# EAGLE design clock (EAGLE 5.11)

## Sheet 1 of 4
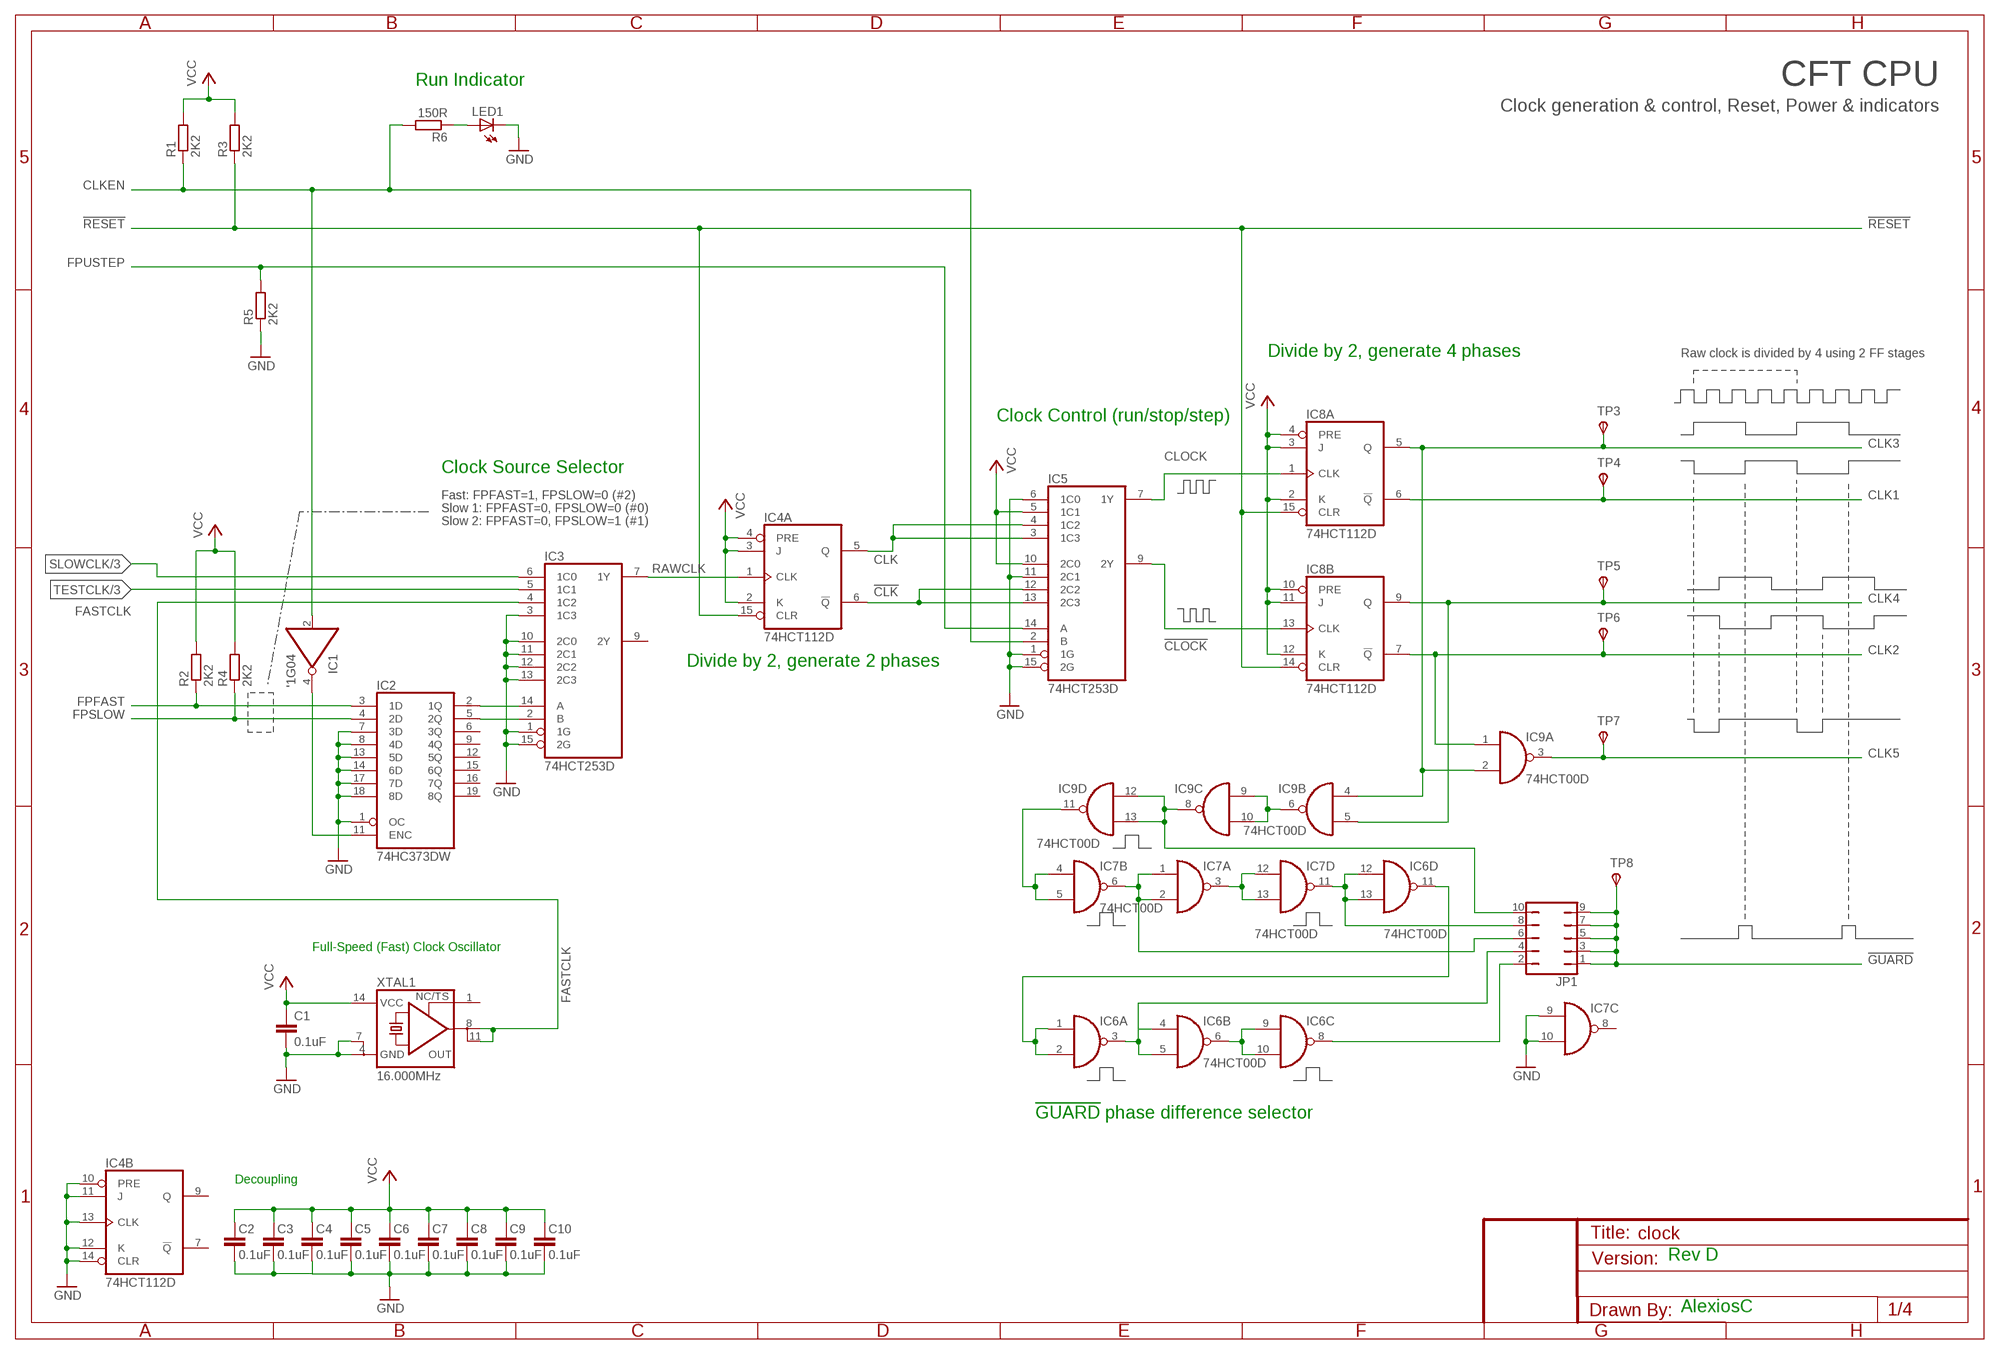
[diagram p0: schematic, sheet 1]

### Parts
C1  0.1uF  C-EUC0805  [C0805]
C2  0.1uF  C-EUC0805  [C0805]
C3  0.1uF  C-EUC0805  [C0805]
C4  0.1uF  C-EUC0805  [C0805]
C5  0.1uF  C-EUC0805  [C0805]
C6  0.1uF  C-EUC0805  [C0805]
C7  0.1uF  C-EUC0805  [C0805]
C8  0.1uF  C-EUC0805  [C0805]
C9  0.1uF  C-EUC0805  [C0805]
C10  0.1uF  C-EUC0805  [C0805]
IC1  '1G04  74AHC1G04DBV  [SOT23-5]
IC2  74HC373DW  [SO20W]
IC3  74HCT253D  [SO16]
IC4  74HCT112D  [SO16]
IC5  74HCT253D  [SO16]
IC6  74HCT00D  [SO14]
IC7  74HCT00D  [SO14]
IC8  74HCT112D  [SO16]
IC9  74HCT00D  [SO14]
JP1  JP5Q  [JP5Q]
LED1  LEDCHIP-LED0805  [CHIP-LED0805]
R1  2K2  R-EU_M0805  [M0805]
R2  2K2  R-EU_M0805  [M0805]
R3  2K2  R-EU_M0805  [M0805]
R4  2K2  R-EU_M0805  [M0805]
R5  2K2  R-EU_R0805  [R0805]
R6  150R  R-EU_R0805  [R0805]
TP3  TPSPAD1-13  [P1-13]
TP4  TPSPAD1-13  [P1-13]
TP5  TPSPAD1-13  [P1-13]
TP6  TPSPAD1-13  [P1-13]
TP7  TPSPAD1-13  [P1-13]
TP8  TPSPAD1-13  [P1-13]
XTAL1  16.000MHz  XO2-08-14-SOCKET  [DIL0814S]

### Nets
!CLK: IC4.6(A:!Q) IC5.12(2C2) IC5.13(2C3)
!CLOCK: IC5.9(2Y) IC8.13(B:CLK)
!GUARD: JP1.1 JP1.3 JP1.5 JP1.7 JP1.9 TP8.TP(PP) ; also sheet 3,4
!RESET: IC4.15(A:CLR) IC8.14(B:CLR) IC8.15(A:CLR) R3.1 ; also sheet 2,3,4
CLK: IC4.5(A:Q) IC5.3(1C3) IC5.4(1C2) ; also sheet 2
CLK1: IC8.6(A:!Q) TP4.TP(PP) ; also sheet 4
CLK2: IC8.7(B:!Q) IC9.1(A:I0) TP6.TP(PP) ; also sheet 4
CLK3: IC8.5(A:Q) IC9.2(A:I1) IC9.4(B:I0) TP3.TP(PP) ; also sheet 4
CLK4: IC8.9(B:Q) IC9.5(B:I1) TP5.TP(PP) ; also sheet 4
CLK5: IC9.3(A:O) TP7.TP(PP) ; also sheet 4
CLKEN: IC1.2(I) IC5.2(B) R1.1 R6.2 ; also sheet 4
CLOCK: IC5.7(1Y) IC8.1(A:CLK)
FASTCLK: IC3.4(1C2) XTAL1.8(OUT) XTAL1.11(OUT1)
FPFAST: IC2.3(1D) R2.1 ; also sheet 4
FPSLOW: IC2.4(2D) R4.1 ; also sheet 4
FPUSTEP: IC5.14(A) R5.2 ; also sheet 4
GND: C1.2 C2.1 C3.1 C4.1 C5.1 C6.1 C7.1 C8.1 C9.1 C10.1 IC2.1(OC) IC2.7(3D) IC2.8(4D) IC2.13(5D) IC2.14(6D) IC2.17(7D) IC2.18(8D) IC3.1(1G) IC3.3(1C3) IC3.10(2C0) IC3.11(2C1) IC3.12(2C2) IC3.13(2C3) IC3.15(2G) IC4.10(B:PRE) IC4.11(B:J) IC4.12(B:K) IC4.13(B:CLK) IC4.14(B:CLR) IC5.1(1G) IC5.6(1C0) IC5.11(2C1) IC5.15(2G) IC7.9(C:I0) IC7.10(C:I1) LED1.C R5.1 XTAL1.4(GND) XTAL1.7(GND1) ; also sheet 2,3,4
N$2: IC6.8(C:O) JP1.2
N$11: IC7.1(A:I0) IC7.2(A:I1) IC7.6(B:O) JP1.6
N$12: IC7.3(A:O) IC7.12(D:I0) IC7.13(D:I1)
N$13: IC6.12(D:I0) IC6.13(D:I1) IC7.11(D:O) JP1.8
N$14: IC6.1(A:I0) IC6.2(A:I1) IC6.11(D:O)
N$15: IC6.3(A:O) IC6.4(B:I0) IC6.5(B:I1) JP1.4
N$16: IC6.6(B:O) IC6.9(C:I0) IC6.10(C:I1)
N$18: IC9.6(B:O) IC9.9(C:I0) IC9.10(C:I1)
N$19: IC9.8(C:O) IC9.12(D:I0) IC9.13(D:I1) JP1.10
N$20: IC7.4(B:I0) IC7.5(B:I1) IC9.11(D:O)
N$34: IC2.2(1Q) IC3.14(A)
N$35: IC2.5(2Q) IC3.2(B)
N$37: IC1.4(O) IC2.11(ENC)
N$49: LED1.A R6.1
RAWCLK: IC3.7(1Y) IC4.1(A:CLK)
SLOWCLK: IC3.6(1C0) ; also sheet 3
TESTCLK: IC3.5(1C1) ; also sheet 3
VCC: C1.1 C2.2 C3.2 C4.2 C5.2 C6.2 C7.2 C8.2 C9.2 C10.2 IC4.2(A:K) IC4.3(A:J) IC4.4(A:PRE) IC5.5(1C1) IC5.10(2C0) IC8.2(A:K) IC8.3(A:J) IC8.4(A:PRE) IC8.10(B:PRE) IC8.11(B:J) IC8.12(B:K) R1.2 R2.2 R3.2 R4.2 XTAL1.14(VCC) ; also sheet 2,3,4
Unconnected: IC2.6(3Q) IC2.9(4Q) IC2.12(5Q) IC2.15(6Q) IC2.16(7Q) IC2.19(8Q) IC3.9(2Y) IC4.7(B:!Q) IC4.9(B:Q) IC7.8(C:O) XTAL1.1(TS)

### Notes on the sheet
- Run Indicator | CFT CPU
- Clock generation & control, Reset, Power & indicators
- Divide by 2, generate 4 phases | Raw clock is divided by 4 using 2 FF stages
- Clock Control (run/stop/step)
- Clock Source Selector
- Fast: FPFAST=1, FPSLOW=0 (#2)
- Slow 1: FPFAST=0, FPSLOW=0 (#0)
- Slow 2: FPFAST=0, FPSLOW=1 (#1)
- Divide by 2, generate 2 phases
- Full-Speed (Fast) Clock Oscillator
- !GUARD! phase difference selector
- Decoupling
- Rev D
- AlexiosC

## Sheet 2 of 4
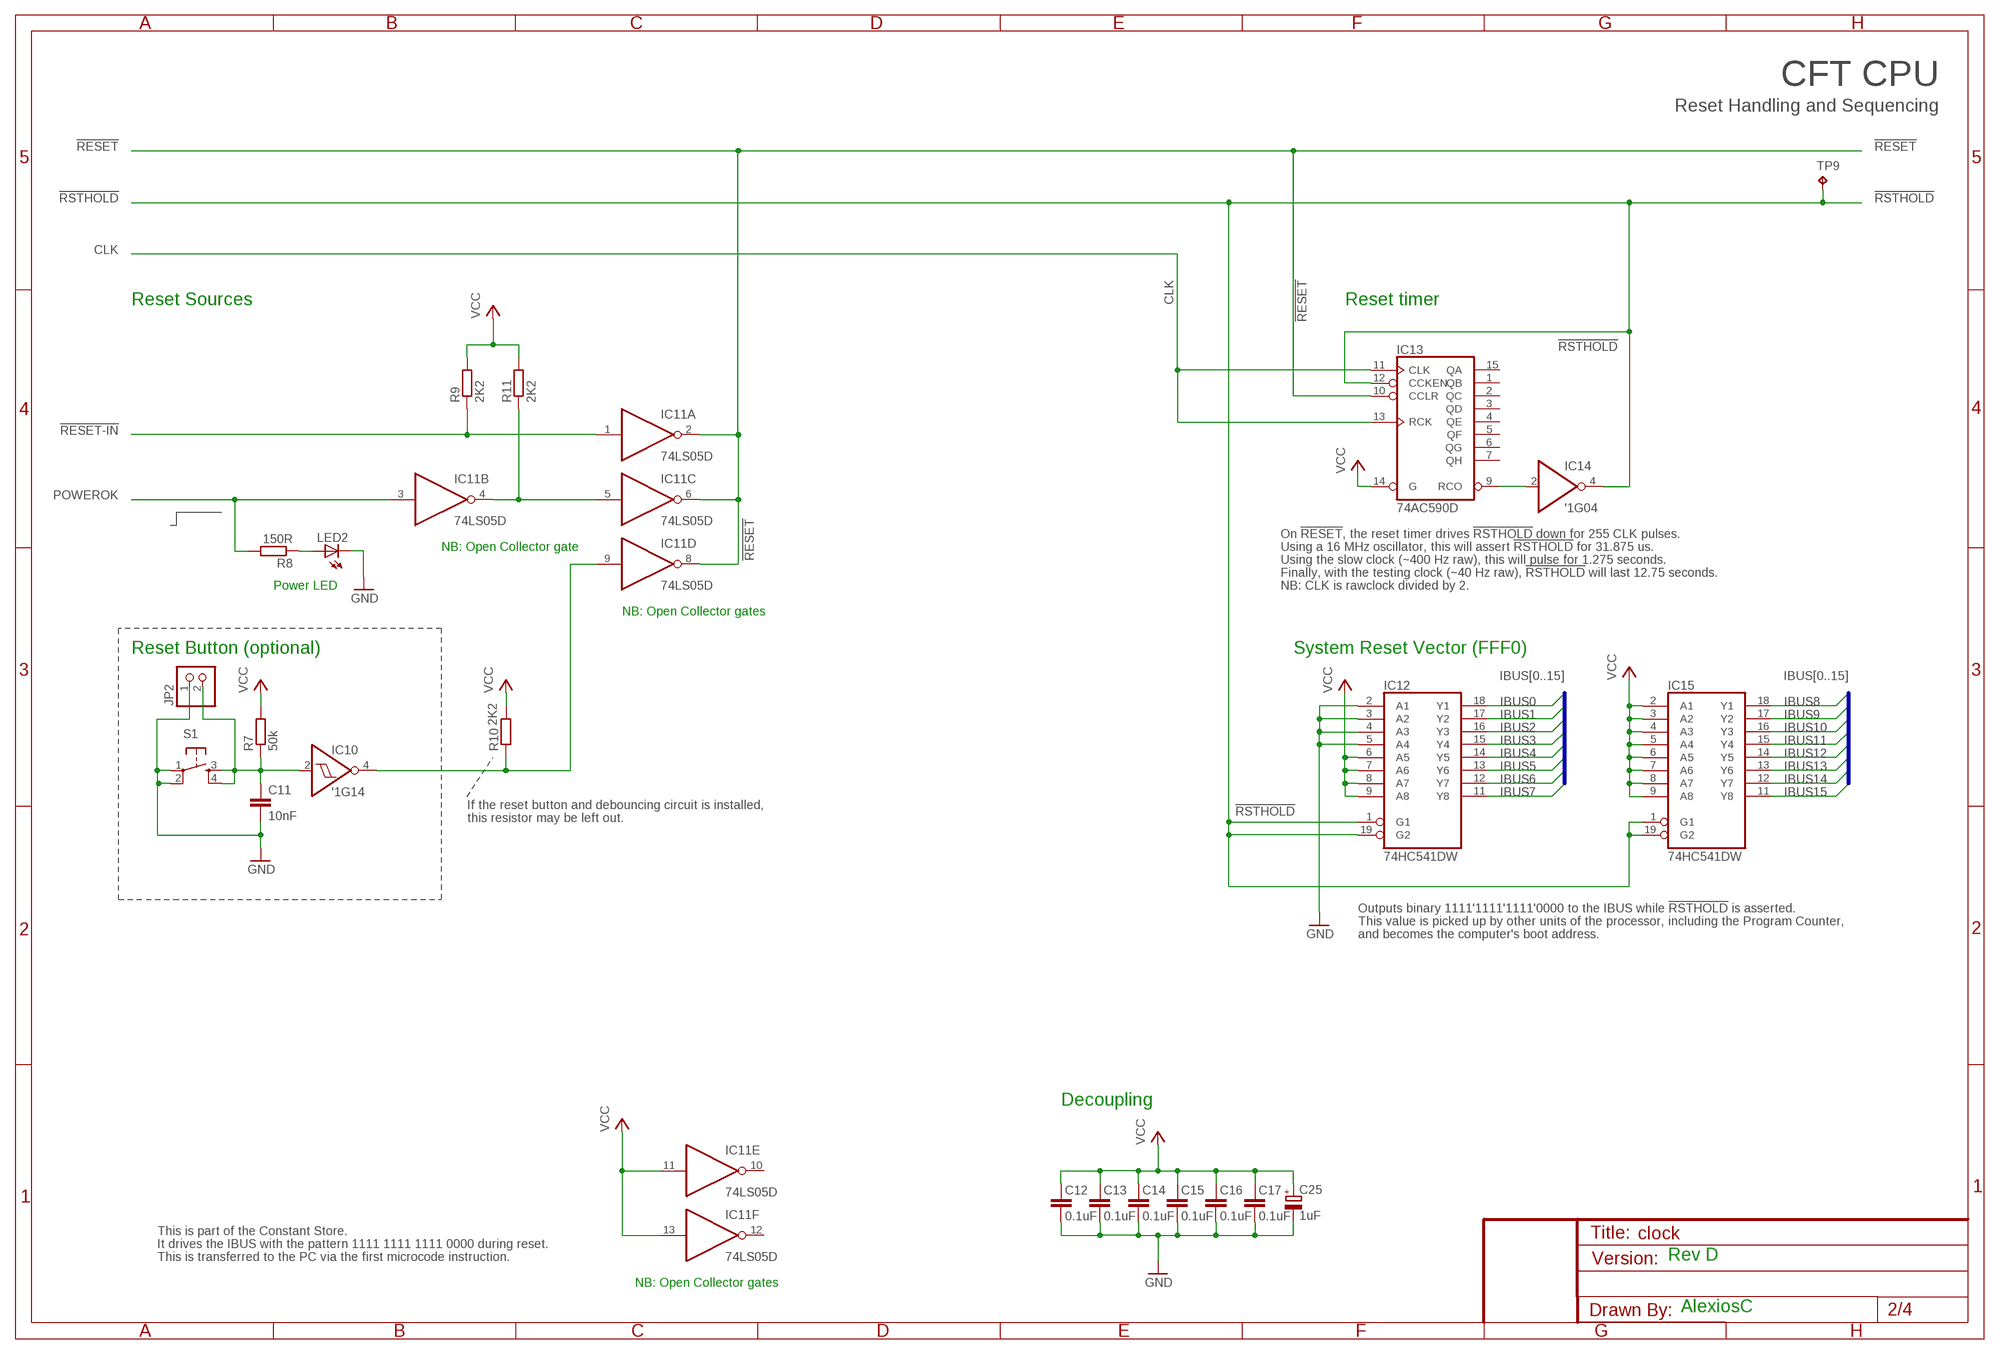
[diagram p1: schematic, sheet 2]

### Parts
C11  10nF  C-EUC0805  [C0805]
C12  0.1uF  C-EUC0805  [C0805]
C13  0.1uF  C-EUC0805  [C0805]
C14  0.1uF  C-EUC0805  [C0805]
C15  0.1uF  C-EUC0805  [C0805]
C16  0.1uF  C-EUC0805  [C0805]
C17  0.1uF  C-EUC0805  [C0805]
C25  1uF  CPOL-EUE2.5-5  [E2,5-5]
IC10  '1G14  74AHC1G14DBV  [SOT23-5]
IC11  74LS05D  [SO14]
IC12  74HC541DW  [SO20W]
IC13  74AC590D  [SO16]
IC14  '1G04  74AHC1G04DBV  [SOT23-5]
IC15  74HC541DW  [SO20W]
JP2  PINHD-1X2  [1X02]
LED2  LEDCHIP-LED0805  [CHIP-LED0805]
R7  50k  R-EU_R0805  [R0805]
R8  150R  R-EU_R0805  [R0805]
R9  2K2  R-EU_R0805  [R0805]
R10  2K2  R-EU_R0805  [R0805]
R11  2K2  R-EU_R0805  [R0805]
S1  TAC_SWITCHPTH  [TACTILE-PTH]
TP9  TPPAD1-13  [P1-13]

### Nets
!RESET: IC11.2(A:O) IC11.6(C:O) IC11.8(D:O) IC13.10(CCLR) ; also sheet 1,3,4
!RESET-IN: IC11.1(A:I) R9.1 ; also sheet 4
!RSTHOLD: IC12.1(G1) IC12.19(G2) IC13.12(CCKEN) IC14.4(O) IC15.1(G1) IC15.19(G2) TP9.TP ; also sheet 4
CLK: IC13.11(CLK) IC13.13(RCK) ; also sheet 1
GND: C11.2 C12.1 C13.1 C14.1 C15.1 C16.1 C17.1 C25.- IC12.2(A1) IC12.3(A2) IC12.4(A3) IC12.5(A4) JP2.1 LED2.C S1.1 S1.2 ; also sheet 1,3,4
IBUS0: IC12.18(Y1) ; also sheet 4
IBUS1: IC12.17(Y2) ; also sheet 4
IBUS2: IC12.16(Y3) ; also sheet 4
IBUS3: IC12.15(Y4) ; also sheet 4
IBUS4: IC12.14(Y5) ; also sheet 4
IBUS5: IC12.13(Y6) ; also sheet 4
IBUS6: IC12.12(Y7) ; also sheet 4
IBUS7: IC12.11(Y8) ; also sheet 4
IBUS8: IC15.18(Y1) ; also sheet 4
IBUS9: IC15.17(Y2) ; also sheet 4
IBUS10: IC15.16(Y3) ; also sheet 4
IBUS11: IC15.15(Y4) ; also sheet 4
IBUS12: IC15.14(Y5) ; also sheet 4
IBUS13: IC15.13(Y6) ; also sheet 4
IBUS14: IC15.12(Y7) ; also sheet 4
IBUS15: IC15.11(Y8) ; also sheet 4
N$5: IC13.9(RCO) IC14.2(I)
N$8: IC10.4(O) IC11.9(D:I) R10.1
N$10: C11.1 IC10.2(I) JP2.2 R7.1 S1.3 S1.4
N$28: IC11.4(B:O) IC11.5(C:I) R11.1
POWERLED: LED2.A R8.1
POWEROK: IC11.3(B:I) R8.2 ; also sheet 4
VCC: C12.2 C13.2 C14.2 C15.2 C16.2 C17.2 C25.+ IC11.11(E:I) IC11.13(F:I) IC12.6(A5) IC12.7(A6) IC12.8(A7) IC12.9(A8) IC13.14(G) IC15.2(A1) IC15.3(A2) IC15.4(A3) IC15.5(A4) IC15.6(A5) IC15.7(A6) IC15.8(A7) IC15.9(A8) R7.2 R9.2 R10.2 R11.2 ; also sheet 1,3,4
Unconnected: IC11.10(E:O) IC11.12(F:O) IC13.1(QB) IC13.2(QC) IC13.3(QD) IC13.4(QE) IC13.5(QF) IC13.6(QG) IC13.7(QH) IC13.15(QA)

### Buses
IBUS[0..15]

### Notes on the sheet
- CFT CPU
- Reset Handling and Sequencing
- Reset Sources | Reset timer
- On !RESET!, the reset timer drives !RSTHOLD! down for 255 CLK pulses.
- NB: Open Collector gate | Using a 16 MHz oscillator, this will assert !RSTHOLD! for 31.875 us.
- Using the slow clock (~400 Hz raw), this will pulse for 1.275 seconds.
- Finally, with the testing clock (~40 Hz raw), !RSTHOLD! will last 12.75 seconds.
- Power LED | NB: CLK is rawclock divided by 2.
- NB: Open Collector gates
- Reset Button (optional) | System Reset Vector (FFF0)
- If the reset button and debouncing circuit is installed,
- this resistor may be left out.
- Outputs binary 1111'1111'1111'0000 to the IBUS while !RSTHOLD! is asserted.
- This value is picked up by other units of the processor, including the Program Counter,
- and becomes the computer's boot address.
- Decoupling
- This is part of the Constant Store.
- It drives the IBUS with the pattern 1111 1111 1111 0000 during reset.
- This is transferred to the PC via the first microcode instruction. | Rev D
- NB: Open Collector gates
- AlexiosC

## Sheet 3 of 4
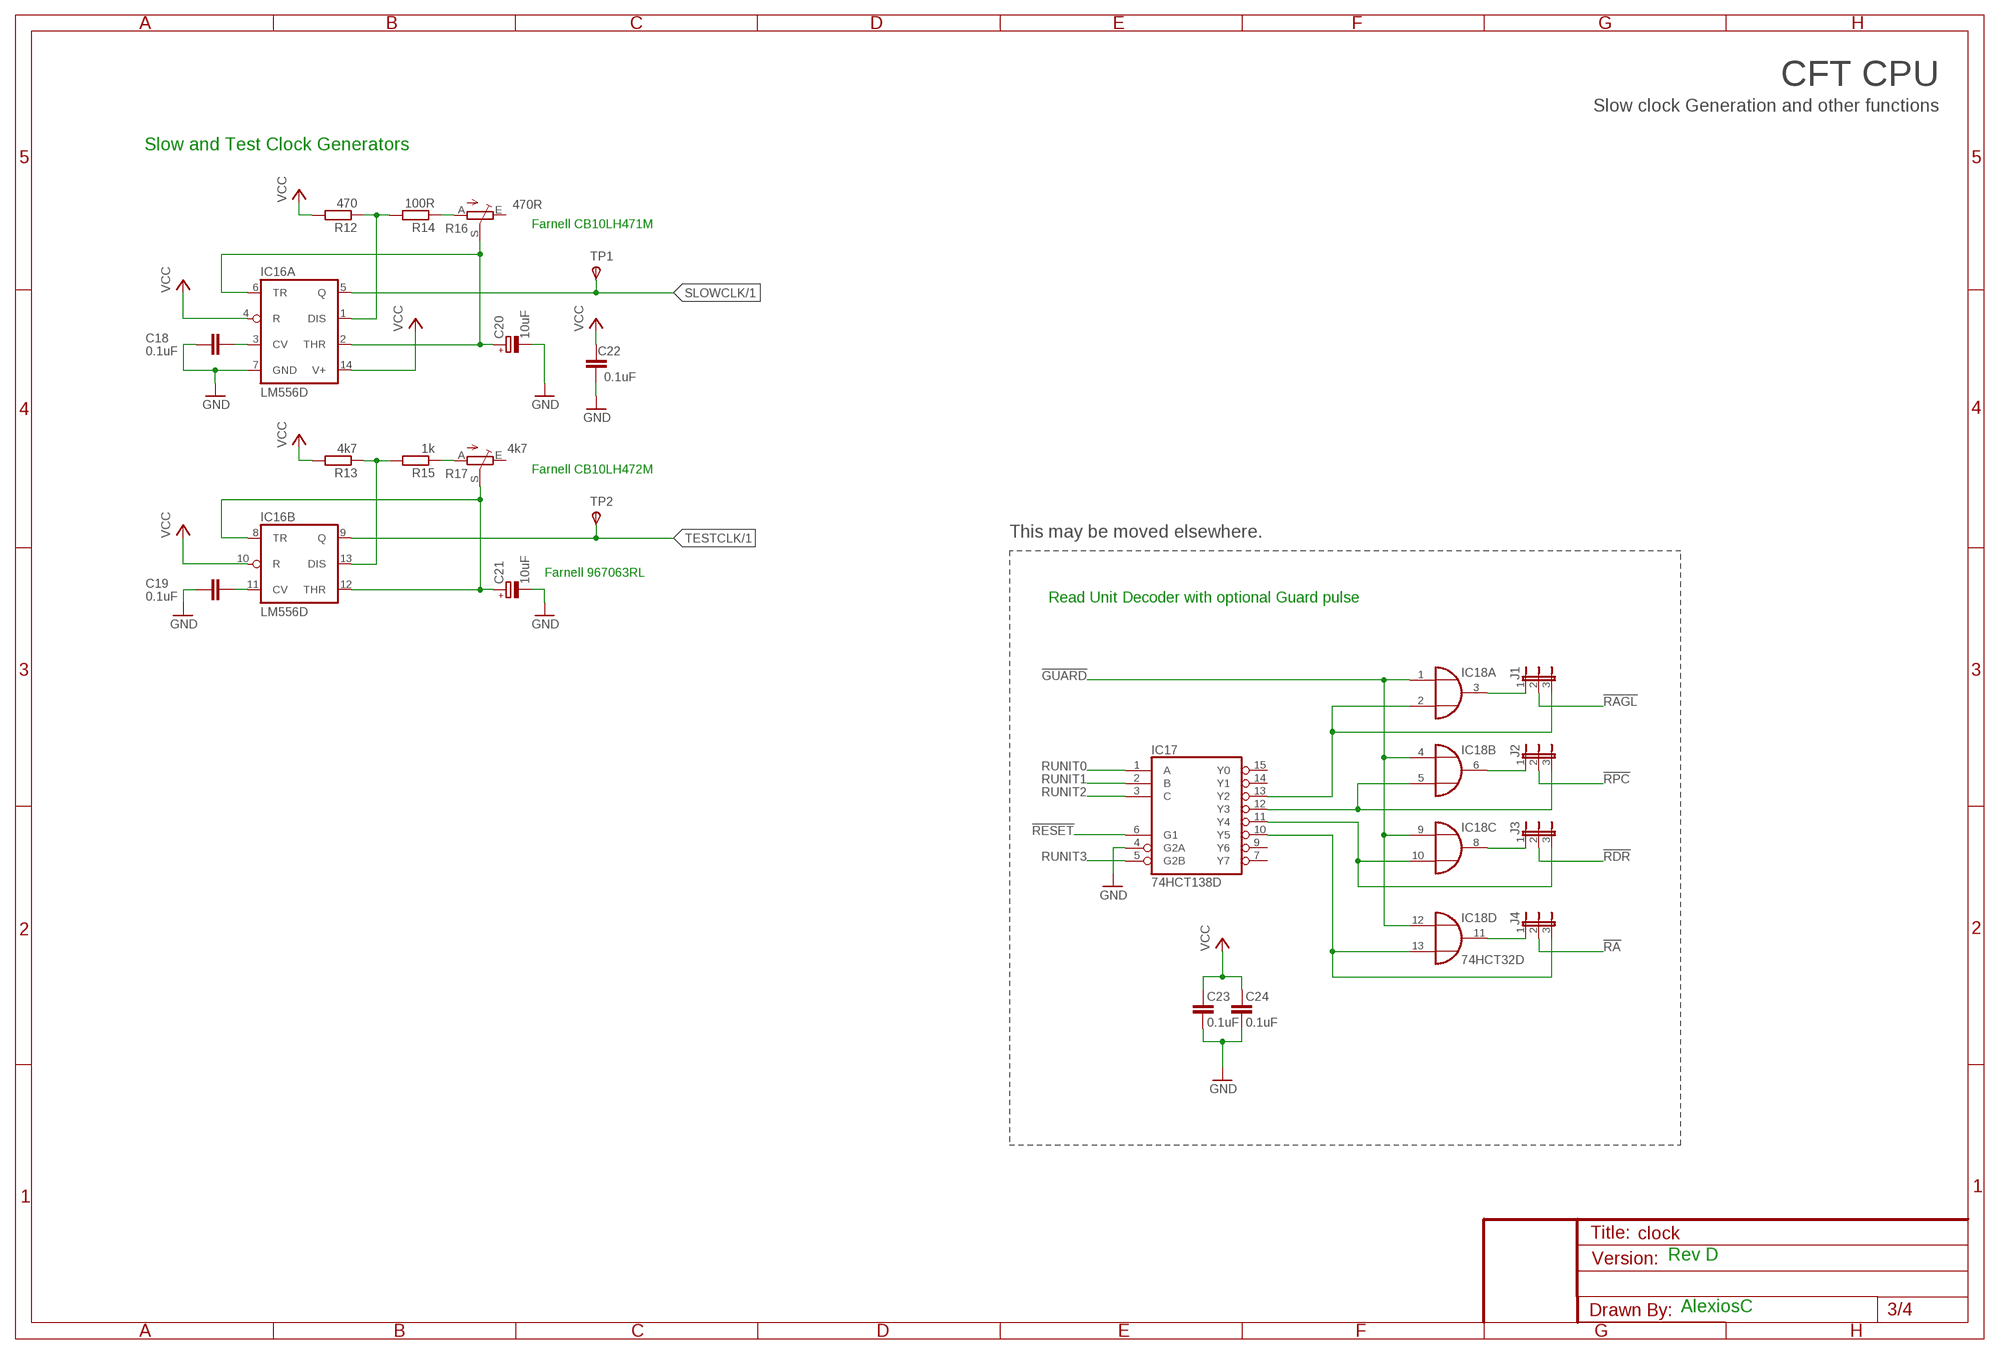
[diagram p2: schematic, sheet 3]

### Parts
C18  0.1uF  C-EUC0805  [C0805]
C19  0.1uF  C-EUC0805  [C0805]
C20  10uF  CPOL-EUB/3528-21R  [B/3528-21R]
C21  10uF  CPOL-EUB/3528-21R  [B/3528-21R]
C22  0.1uF  C-EUC0805  [C0805]
C23  0.1uF  C-EUC0805  [C0805]
C24  0.1uF  C-EUC0805  [C0805]
IC16  LM556D  [SO14]
IC17  74HCT138D  [SO16]
IC18  74HCT32D  [SO14]
J1  JP2E  [JP2]
J2  JP2E  [JP2]
J3  JP2E  [JP2]
J4  JP2E  [JP2]
R12  470  R-EU_R0805  [R0805]
R13  4k7  R-EU_R0805  [R0805]
R14  100R  R-EU_R0805  [R0805]
R15  1k  R-EU_R0805  [R0805]
R16  470R  TRIM_EU-CT6  [CT6]
R17  4k7  TRIM_EU-CT6  [CT6]
TP1  TPSPAD1-13  [P1-13]
TP2  TPSPAD1-13  [P1-13]

### Nets
!GUARD: IC18.1(A:I0) IC18.4(B:I0) IC18.9(C:I0) IC18.12(D:I0) ; also sheet 1,4
!RA: J4.2
!RAGL: J1.2
!RDR: J3.2 ; also sheet 4
!RESET: IC17.6(G1) ; also sheet 1,2,4
!RPC: J2.2 ; also sheet 4
GND: C18.1 C19.1 C20.- C21.- C22.1 C23.1 C24.1 IC16.7(A:GND) IC17.4(G2A) ; also sheet 1,2,4
N$6: C18.2 IC16.3(A:CV)
N$9: C21.+ IC16.8(B:TR) IC16.12(B:THR) R17.S
N$17: IC17.13(Y2) IC18.2(A:I1) J1.3
N$21: IC17.12(Y3) IC18.5(B:I1) J2.3
N$22: IC17.11(Y4) IC18.10(C:I1) J3.3
N$23: IC17.10(Y5) IC18.13(D:I1) J4.3
N$24: IC18.3(A:O) J1.1
N$25: IC18.6(B:O) J2.1
N$26: IC18.11(D:O) J4.1
N$27: IC18.8(C:O) J3.1
N$29: IC16.1(A:DIS) R12.1 R14.2
N$30: IC16.13(B:DIS) R13.1 R15.2
N$31: C20.+ IC16.2(A:THR) IC16.6(A:TR) R16.S
N$32: R14.1 R16.A
N$33: R15.1 R17.A
N$36: C19.2 IC16.11(B:CV)
RUNIT0: IC17.1(A)
RUNIT1: IC17.2(B)
RUNIT2: IC17.3(C)
RUNIT3: IC17.5(G2B)
SLOWCLK: IC16.5(A:Q) TP1.TP(PP) ; also sheet 1
TESTCLK: IC16.9(B:Q) TP2.TP(PP) ; also sheet 1
VCC: C22.2 C23.2 C24.2 IC16.4(A:R) IC16.10(B:R) IC16.14(A:V+) R12.2 R13.2 ; also sheet 1,2,4
Unconnected: IC17.7(Y7) IC17.9(Y6) IC17.14(Y1) IC17.15(Y0) R16.E R17.E

### Notes on the sheet
- CFT CPU
- Slow clock Generation and other functions
- Slow and Test Clock Generators
- Farnell CB10LH471M
- Farnell CB10LH472M
- This may be moved elsewhere.
- Farnell 967063RL
- Read Unit Decoder with optional Guard pulse
- Rev D
- AlexiosC

## Sheet 4 of 4
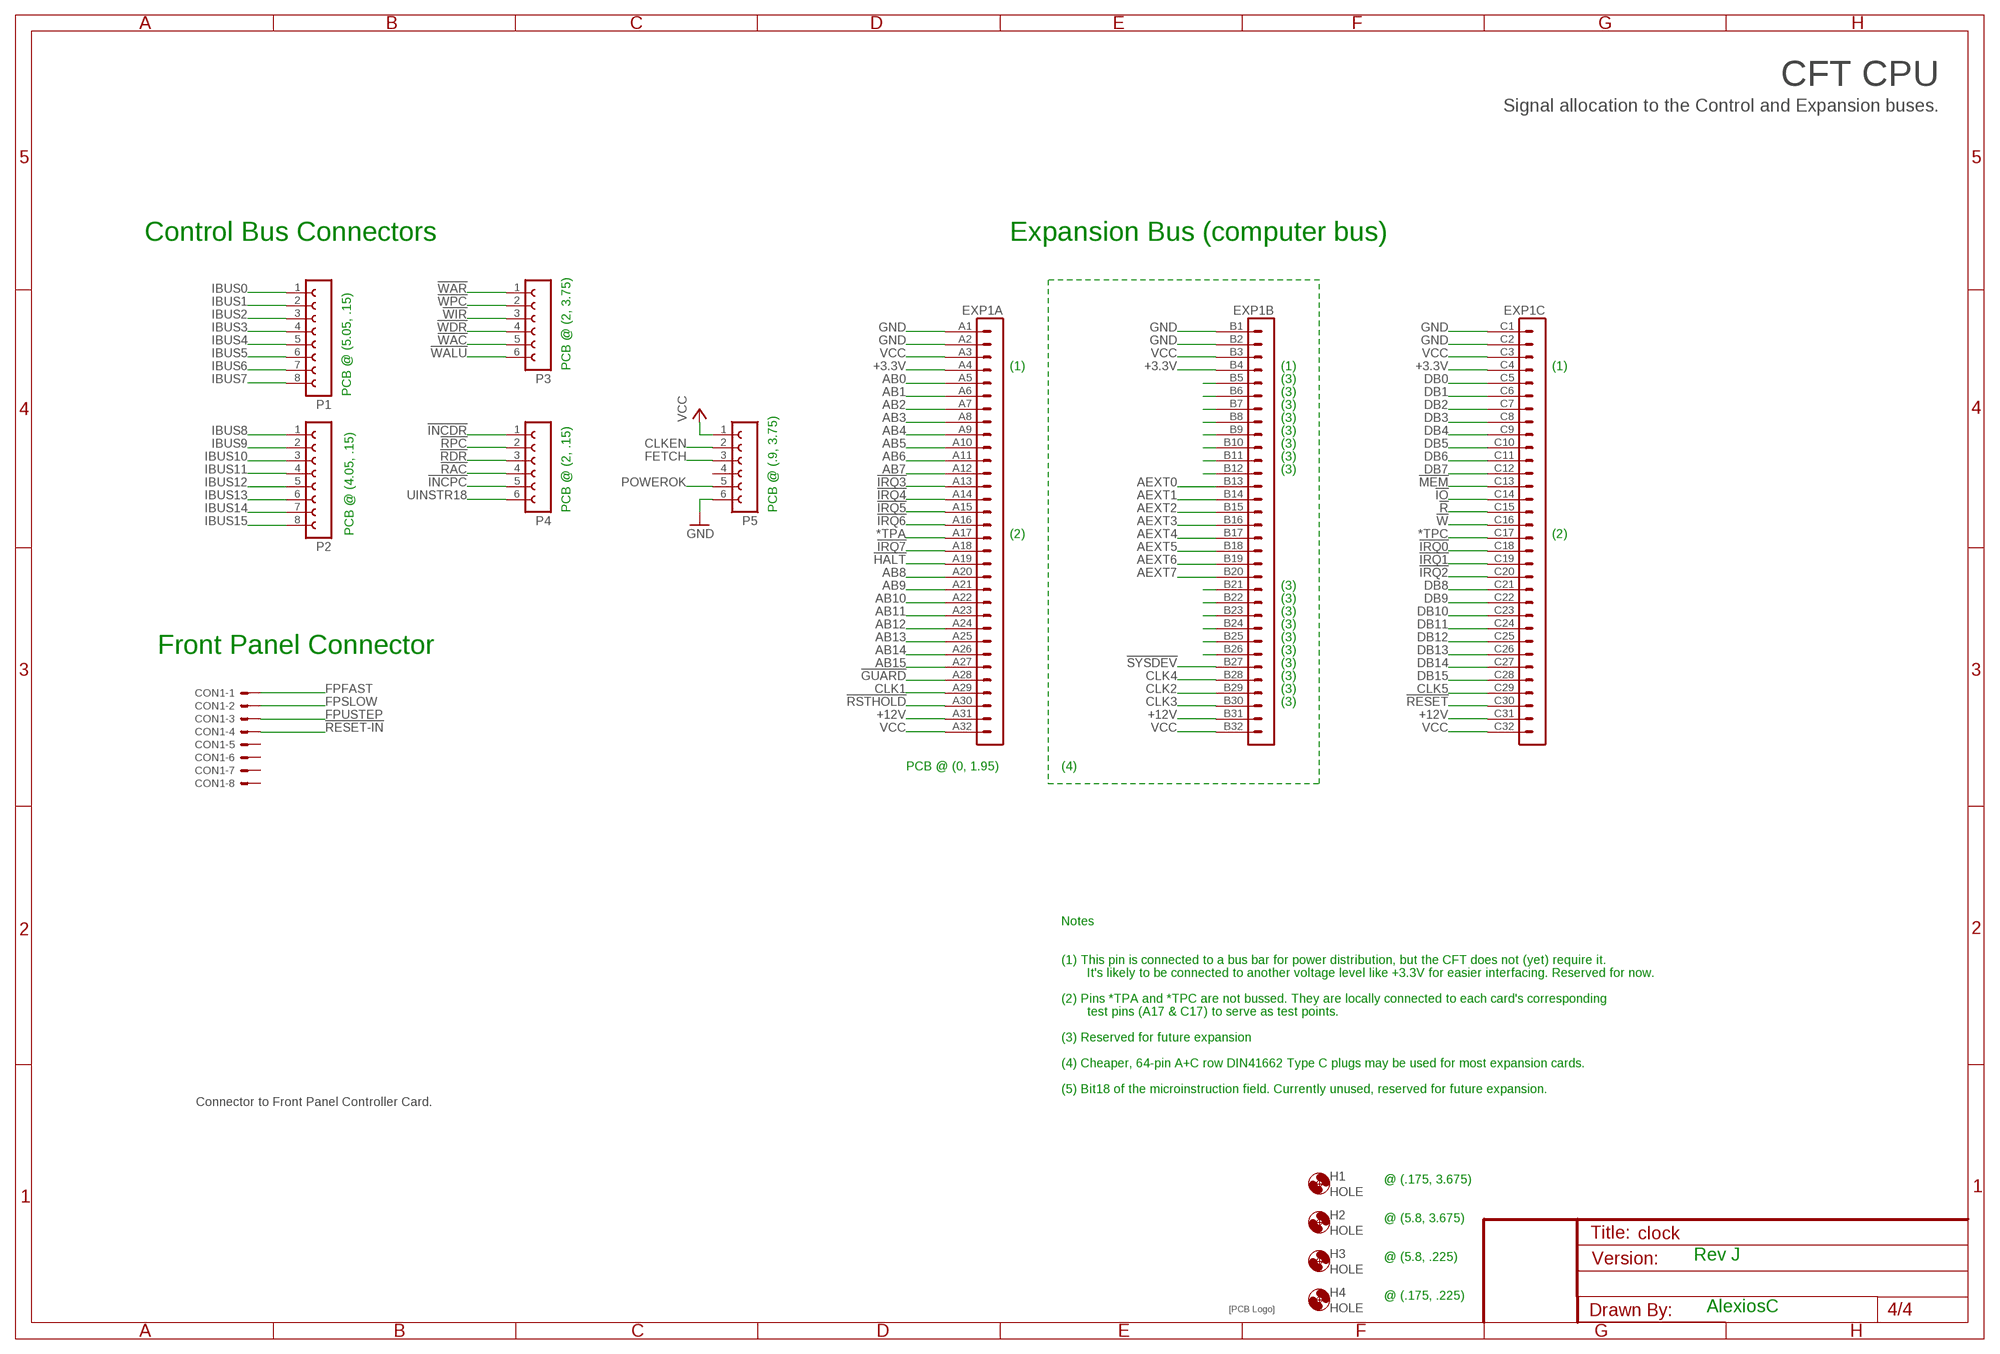
[diagram p3: schematic, sheet 4]

### Parts
CON1  22-23-2081  [22-23-2081]
EXP1  VG96-3K  [VG96K]
H1  HOLE  [STANDOFF_28_60]
H2  HOLE  [STANDOFF_28_60]
H3  HOLE  [STANDOFF_28_60]
H4  HOLE  [STANDOFF_28_60]
P1  FE08-1  [FE08]
P2  FE08-1  [FE08]
P3  FE06-1  [FE06]
P4  FE06-1  [FE06]
P5  FE06-1  [FE06]
U$1  SIGNATURESILK  [SIGNATURE]

### Nets
!GUARD: EXP1.A28 ; also sheet 1,3
!HALT: EXP1.A19
!INCPC: P4.5
!IO: EXP1.C14
!IRQ0: EXP1.C18
!IRQ1: EXP1.C19
!IRQ2: EXP1.C20
!IRQ3: EXP1.A13
!IRQ4: EXP1.A14
!IRQ5: EXP1.A15
!IRQ6: EXP1.A16
!IRQ7: EXP1.A18
!MEM: EXP1.C13
!R: EXP1.C15
!RAC: P4.4
!RDR: P4.3 ; also sheet 3
!RESET: EXP1.C30 ; also sheet 1,2,3
!RESET-IN: CON1.4 ; also sheet 2
!RPC: P4.2 ; also sheet 3
!RSTHOLD: EXP1.A30 ; also sheet 2
!SYSDEV: EXP1.B27
!W: EXP1.C16
!WAC: P3.5
!WALU: P3.6
!WAR: P3.1
!WDR: P3.4
!WIR: P3.3
!WPC: P3.2
*TPA: EXP1.A17
*TPC: EXP1.C17
+3.3V: EXP1.A4 EXP1.B4 EXP1.C4
+12V [12V]: EXP1.A31 EXP1.B31 EXP1.C31
AB0: EXP1.A5
AB1: EXP1.A6
AB2: EXP1.A7
AB3: EXP1.A8
AB4: EXP1.A9
AB5: EXP1.A10
AB6: EXP1.A11
AB7: EXP1.A12
AB8: EXP1.A20
AB9: EXP1.A21
AB10: EXP1.A22
AB11: EXP1.A23
AB12: EXP1.A24
AB13: EXP1.A25
AB14: EXP1.A26
AB15: EXP1.A27
AEXT0: EXP1.B13
AEXT1: EXP1.B14
AEXT2: EXP1.B15
AEXT3: EXP1.B16
AEXT4: EXP1.B17
AEXT5: EXP1.B18
AEXT6: EXP1.B19
AEXT7: EXP1.B20
CLK1: EXP1.A29 ; also sheet 1
CLK2: EXP1.B29 ; also sheet 1
CLK3: EXP1.B30 ; also sheet 1
CLK4: EXP1.B28 ; also sheet 1
CLK5: EXP1.C29 ; also sheet 1
CLKEN: P5.2 ; also sheet 1
DB0: EXP1.C5
DB1: EXP1.C6
DB2: EXP1.C7
DB3: EXP1.C8
DB4: EXP1.C9
DB5: EXP1.C10
DB6: EXP1.C11
DB7: EXP1.C12
DB8: EXP1.C21
DB9: EXP1.C22
DB10: EXP1.C23
DB11: EXP1.C24
DB12: EXP1.C25
DB13: EXP1.C26
DB14: EXP1.C27
DB15: EXP1.C28
FETCH: P5.3
FPFAST: CON1.1 ; also sheet 1
FPSLOW: CON1.2 ; also sheet 1
FPUSTEP: CON1.3 ; also sheet 1
GND: EXP1.A1 EXP1.A2 EXP1.B1 EXP1.B2 EXP1.C1 EXP1.C2 P5.6 ; also sheet 1,2,3
IBUS0: P1.1 ; also sheet 2
IBUS1: P1.2 ; also sheet 2
IBUS2: P1.3 ; also sheet 2
IBUS3: P1.4 ; also sheet 2
IBUS4: P1.5 ; also sheet 2
IBUS5: P1.6 ; also sheet 2
IBUS6: P1.7 ; also sheet 2
IBUS7: P1.8 ; also sheet 2
IBUS8: P2.1 ; also sheet 2
IBUS9: P2.2 ; also sheet 2
IBUS10: P2.3 ; also sheet 2
IBUS11: P2.4 ; also sheet 2
IBUS12: P2.5 ; also sheet 2
IBUS13: P2.6 ; also sheet 2
IBUS14: P2.7 ; also sheet 2
IBUS15: P2.8 ; also sheet 2
N$1: EXP1.B12
N$3: EXP1.B11
N$4: EXP1.B10
N$7: EXP1.B9
N$42: EXP1.B8
N$43: EXP1.B7
N$44: EXP1.B6
N$45: EXP1.B5
N$46: EXP1.B26
N$47: EXP1.B25
N$48: EXP1.B24
N$50: EXP1.B23
N$51: EXP1.B22
N$52: EXP1.B21
POWEROK: P5.5 ; also sheet 2
UINSTR18: P4.6
VCC: EXP1.A3 EXP1.A32 EXP1.B3 EXP1.B32 EXP1.C3 EXP1.C32 P5.1 ; also sheet 1,2,3
Unconnected: CON1.5 CON1.6 CON1.7 CON1.8 P4.1 P5.4

### Notes on the sheet
- CFT CPU
- Signal allocation to the Control and Expansion buses.
- Control Bus Connectors | Expansion Bus (computer bus)
- PCB @ (2, 3.75) | (1) | (1) | (1)
- (3)
- PCB @ (5.05, .15) | (3)
- (3)
- (3)
- (3)
- (3)
- (3)
- (3)
- PCB @ (2, .15) | PCB @ (.9, 3.75)
- PCB @ (4.05, .15) | (2) | (2)
- (3)
- (3)
- (3)
- (3)
- (3)
- Front Panel Connector | (3)
- (3)
- (3)
- (3)
- (3)
- PCB @ (0, 1.95) | (4)
- Notes
- (1) This pin is connected to a bus bar for power distribution, but the CFT does not (yet) require it.
- It's likely to be connected to another voltage level like +3.3V for easier interfacing. Reserved for now.
- (2) Pins *TPA and *TPC are not bussed. They are locally connected to each card's corresponding
- test pins (A17 & C17) to serve as test points.
- (3) Reserved for future expansion
- (4) Cheaper, 64-pin A+C row DIN41662 Type C plugs may be used for most expansion cards.
- (5) Bit18 of the microinstruction field. Currently unused, reserved for future expansion.
- Connector to Front Panel Controller Card.
- @ (.175, 3.675)
- @ (5.8, 3.675)
- @ (5.8, .225) | Rev J
- @ (.175, .225)
- AlexiosC

## Power pins joined to a net without a drawn wire
GND: IC1.3(GND) IC2.10(GND) IC3.8(GND) IC4.8(P:GND) IC5.8(GND) IC6.7(P:GND) IC7.7(P:GND) IC8.8(P:GND) IC9.7(P:GND) IC10.3(GND) IC11.7(P:GND) IC12.10(GND) IC13.8(GND) IC14.3(GND) IC15.10(GND) IC17.8(GND) IC18.7(P:GND)
VCC: IC1.5(VCC) IC2.20(VCC) IC3.16(VCC) IC4.16(P:VCC) IC5.16(VCC) IC6.14(P:VCC) IC7.14(P:VCC) IC8.16(P:VCC) IC9.14(P:VCC) IC10.5(VCC) IC11.14(P:VCC) IC12.20(VCC) IC13.16(VCC) IC14.5(VCC) IC15.20(VCC) IC17.16(VCC) IC18.14(P:VCC)

## Library data of the parts
C1-C10 C12-C19 C22-C24 = rcl:C-EU: CAPACITOR, European symbol
C11 = resistor:C-EU: CAPACITOR, European symbol
C20 C21 C25 = rcl:CPOL-EU: POLARIZED CAPACITOR, European symbol
CON1 = con-molex:22-23-2081: .100" (2.54mm) Center Header - 8 Pin; MF: MOLEX; MPN: 22-23-2081; OC_FARNELL: 1756826; OC_NEWARK: 01C7592
EXP1 = alexios-19inch:VG96-3: PCB EUROCARD, 96-pin type C/ABC, 2.54 mm
H1-H4 = alexios:HOLE: Hole for a standoff or mount. Hole diameter: 3.3mm. External Diameter: 6mm.
IC1 IC14 = 74xx-little-de:74*1G04: INVERTER Gate
IC2 = 74xx-eu:74*373: Octal D type transparent LATCH, edge triggered
IC3 IC5 = 74xx-eu:74*253: Dual 4-to 1 line data SELECTOR/MULTIPLEXER, 3-state
IC4 IC8 = 74xx-eu:74*112: Dual J-K negative edge triggered FLIP FLOP, preset and clear
IC6 IC7 IC9 = 74xx-eu:74*00: Quad 2-input NAND gate
IC10 = 74xx-little-de:74*1G14: Single Schmitt-Trigger Inverter Gate
IC11 = 74xx-us:74*05: Hex INVERTER, open collector
IC12 IC15 = 74xx-eu:74*541: Octal BUFFER and LINE DRIVER, 3-state
IC13 = 74xx-eu:74*590: 8-bit binary COUNTER, output register
IC16 = linear:*556: Dual TIMER
IC17 = 74xx-eu:74*138: 3-line to 8-line DECODER/DEMULTIPLEXER
IC18 = 74xx-eu:74*32: Quad 2-input OR gate
J1-J4 = jumper:JP2E: JUMPER
JP1 = jumper:JP5Q: JUMPER
JP2 = pinhead:PINHD-1X2: PIN HEADER
LED1 LED2 = led:LED: LED OSRAM: - CHIPLED LG R971, LG N971, LY N971, LG Q971, LY Q971, LO R971, LY R971 LH N974, LH R974 LS Q976, LO Q976, LY Q976 LO Q996 - Hyper CHIPLED LW Q18S LB Q993, LB Q99A, LB R99A - SideLED LS A670, LO A670, LY A670, LG A670, LP A670 LB A673, LV A673, LT A673, LW A673 LH A674 LY A675 LS A676, LA A676, LO A676, LY A676, LW A676 LS A679, LY A679, LG A679 - Hyper Micro SIDELED® LS Y876, LA Y876, LO Y876, LY Y876 LT Y87S - SmartLED LW L88C, LW L88S LB L89C, LB L89S, LG L890 LS L89K, LO L89K, LY L89K LS L896, LA L896, LO L896, LY L896 - TOPLED LS T670, LO T670, LY T670, LG T670, LP T670 LSG T670, LSP T670, LSY T670, LOP T670, LYG T670 LG T671, LOG T671, LSG T671 LB T673, LV T673, LT T673, LW T673 LH T674 LS T676, LA T676, LO T676, LY T676, LB T676, LH T676, LSB T676, LW T676 LB T67C, LV T67C, LT T67C, LS T67K, LO T67K, LY T67K, LW E67C LS E67B, LA E67B, LO E67B, LY E67B, LB E67C, LV E67C, LT E67C LW T67C LS T679, LY T679, LG T679 LS T770, LO T770, LY T770, LG T770, LP T770 LB T773, LV T773, LT T773, LW T773 LH T774 LS E675, LA E675, LY E675, LS T675 LS T776, LA T776, LO T776, LY T776, LB T776 LHGB T686 LT T68C, LB T68C - Hyper Mini TOPLED® LB M676 - Mini TOPLED Santana® LG M470 LS M47K, LO M47K, LY M47K Source: http://www.osram.convergy.de LUXEON: - LUMILED® LXK2-PW12-R00, LXK2-PW12-S00, LXK2-PW14-U00, LXK2-PW14-V00 LXK2-PM12-R00, LXK2-PM12-S00, LXK2-PM14-U00 LXK2-PE12-Q00, LXK2-PE12-R00, LXK2-PE12-S00, LXK2-PE14-T00, LXK2-PE14-U00 LXK2-PB12-K00, LXK2-PB12-L00, LXK2-PB12-M00, LXK2-PB14-N00, LXK2-PB14-P00, LXK2-PB14-Q00 LXK2-PR12-L00, LXK2-PR12-M00, LXK2-PR14-Q00, LXK2-PR14-R00 LXK2-PD12-Q00, LXK2-PD12-R00, LXK2-PD12-S00 LXK2-PH12-R00, LXK2-PH12-S00 LXK2-PL12-P00, LXK2-PL12-Q00, LXK2-PL12-R00 Source: www.luxeon.com KINGBRIGHT: KA-3528ASYC Source: www.kingbright.com
P1 P2 = con-lsta:FE08-1: FEMALE HEADER; OC_FARNELL: unknown; OC_NEWARK: unknown
P3-P5 = con-lsta:FE06-1: FEMALE HEADER; OC_FARNELL: unknown; OC_NEWARK: unknown
R1-R15 = resistor:R-EU_: RESISTOR, European symbol
R16 R17 = pot:TRIM_EU-: POTENTIOMETER
S1 = SparkFun:TAC_SWITCH: Momentary Switch Button commonly used for reset or general input. Spark Fun Electronics SKU : COM-00097
TP1-TP8 = testpad:TPS: TEST PIN
TP9 = testpad:TP: Test pad
U$1 = alexios:SIGNATURE: Soup signature
XTAL1 = alexios:XO2-: Crystal Oscillator Crystal oscillator compatible with both DIL14 and DIL08 packages, with or without sockets.

## Net classes
0 default: width 0.305 mm, clearance 0.254 mm
1 Power: width 0.635 mm, clearance 0.635 mm
2 12V: width 0.635 mm, clearance 0.635 mm

## Board
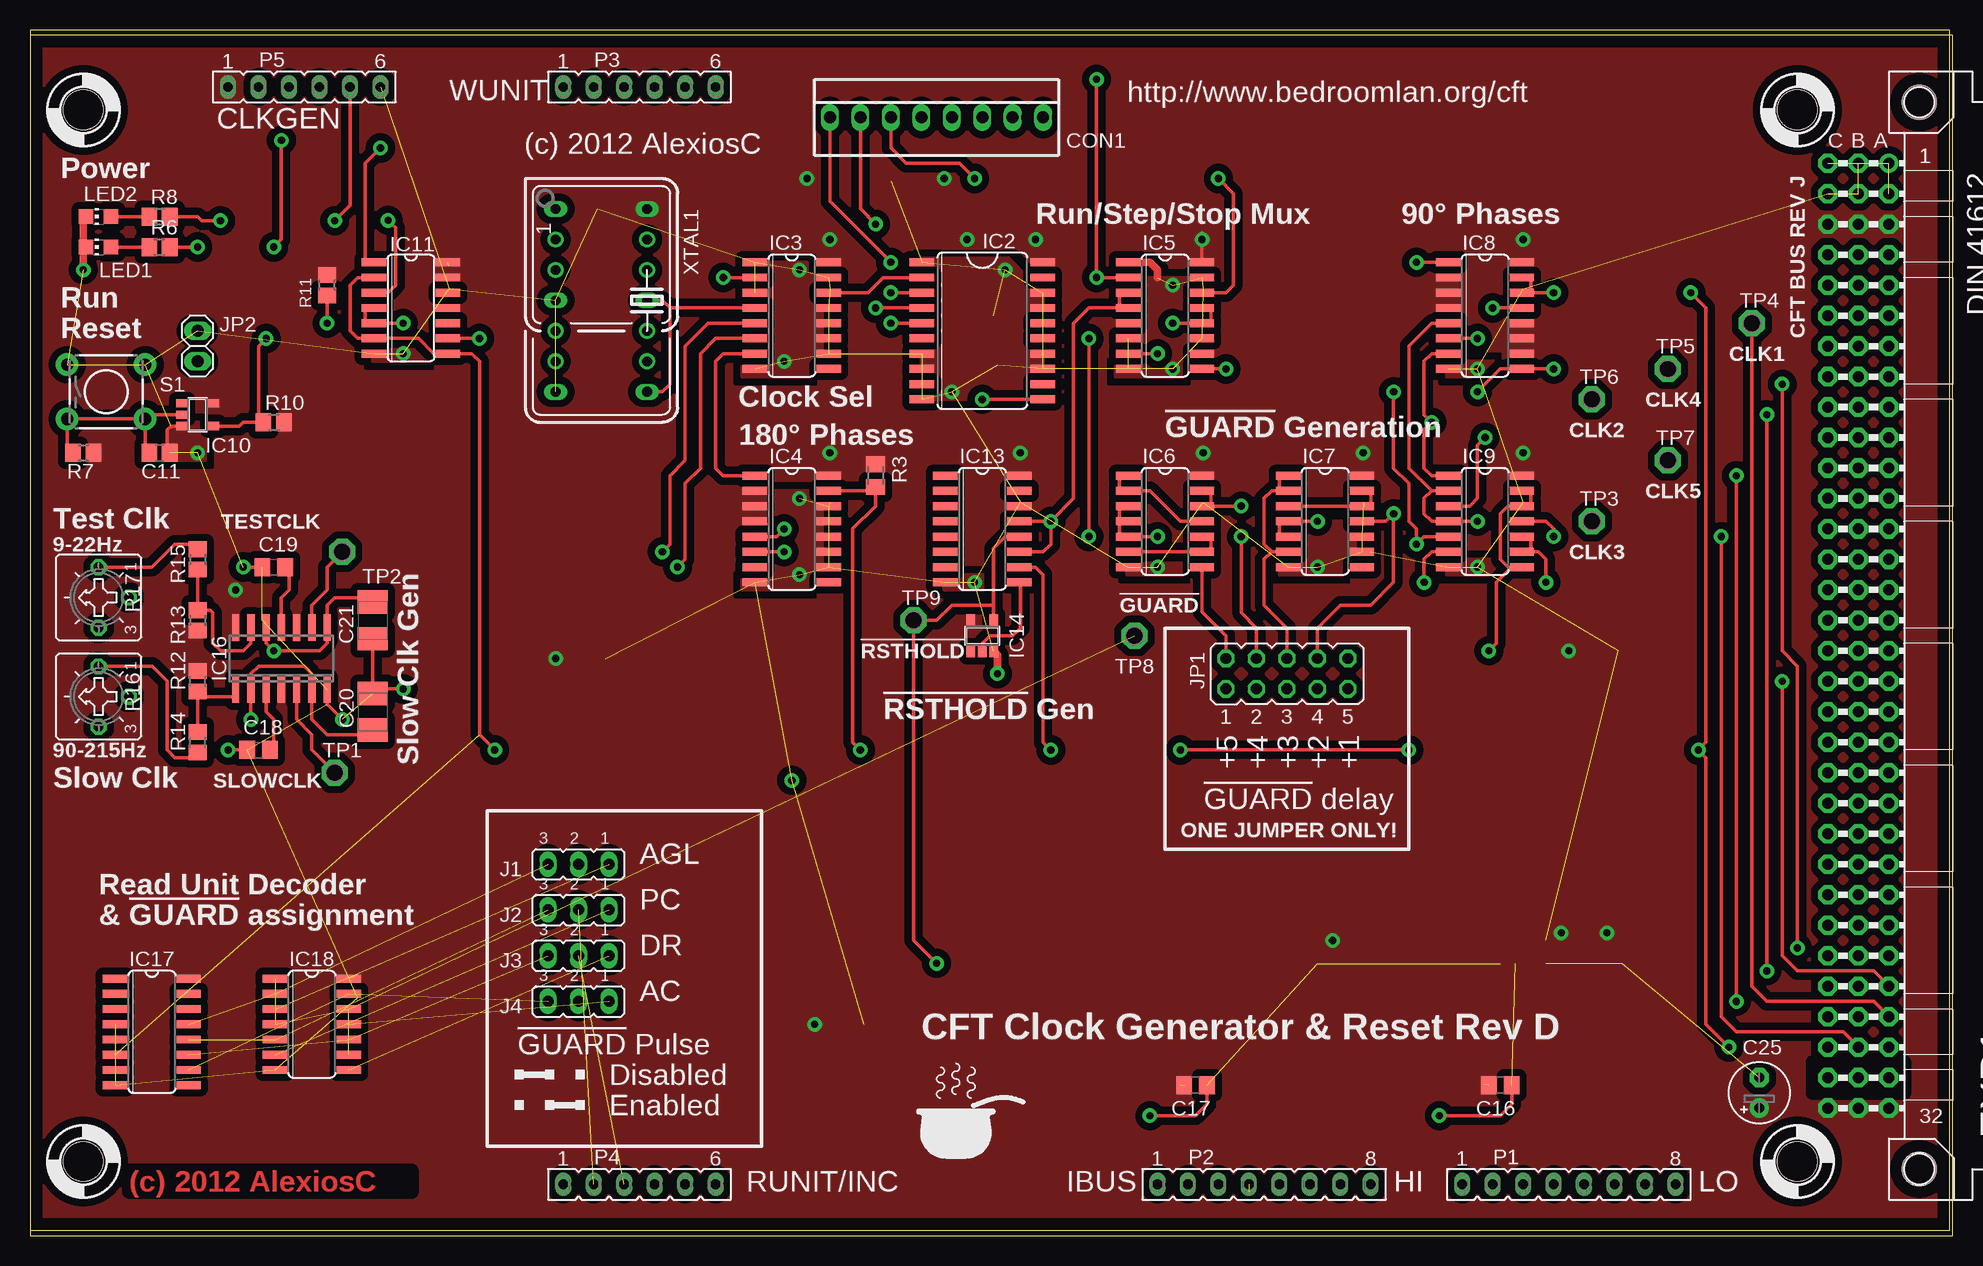
[diagram p4: board, top side]
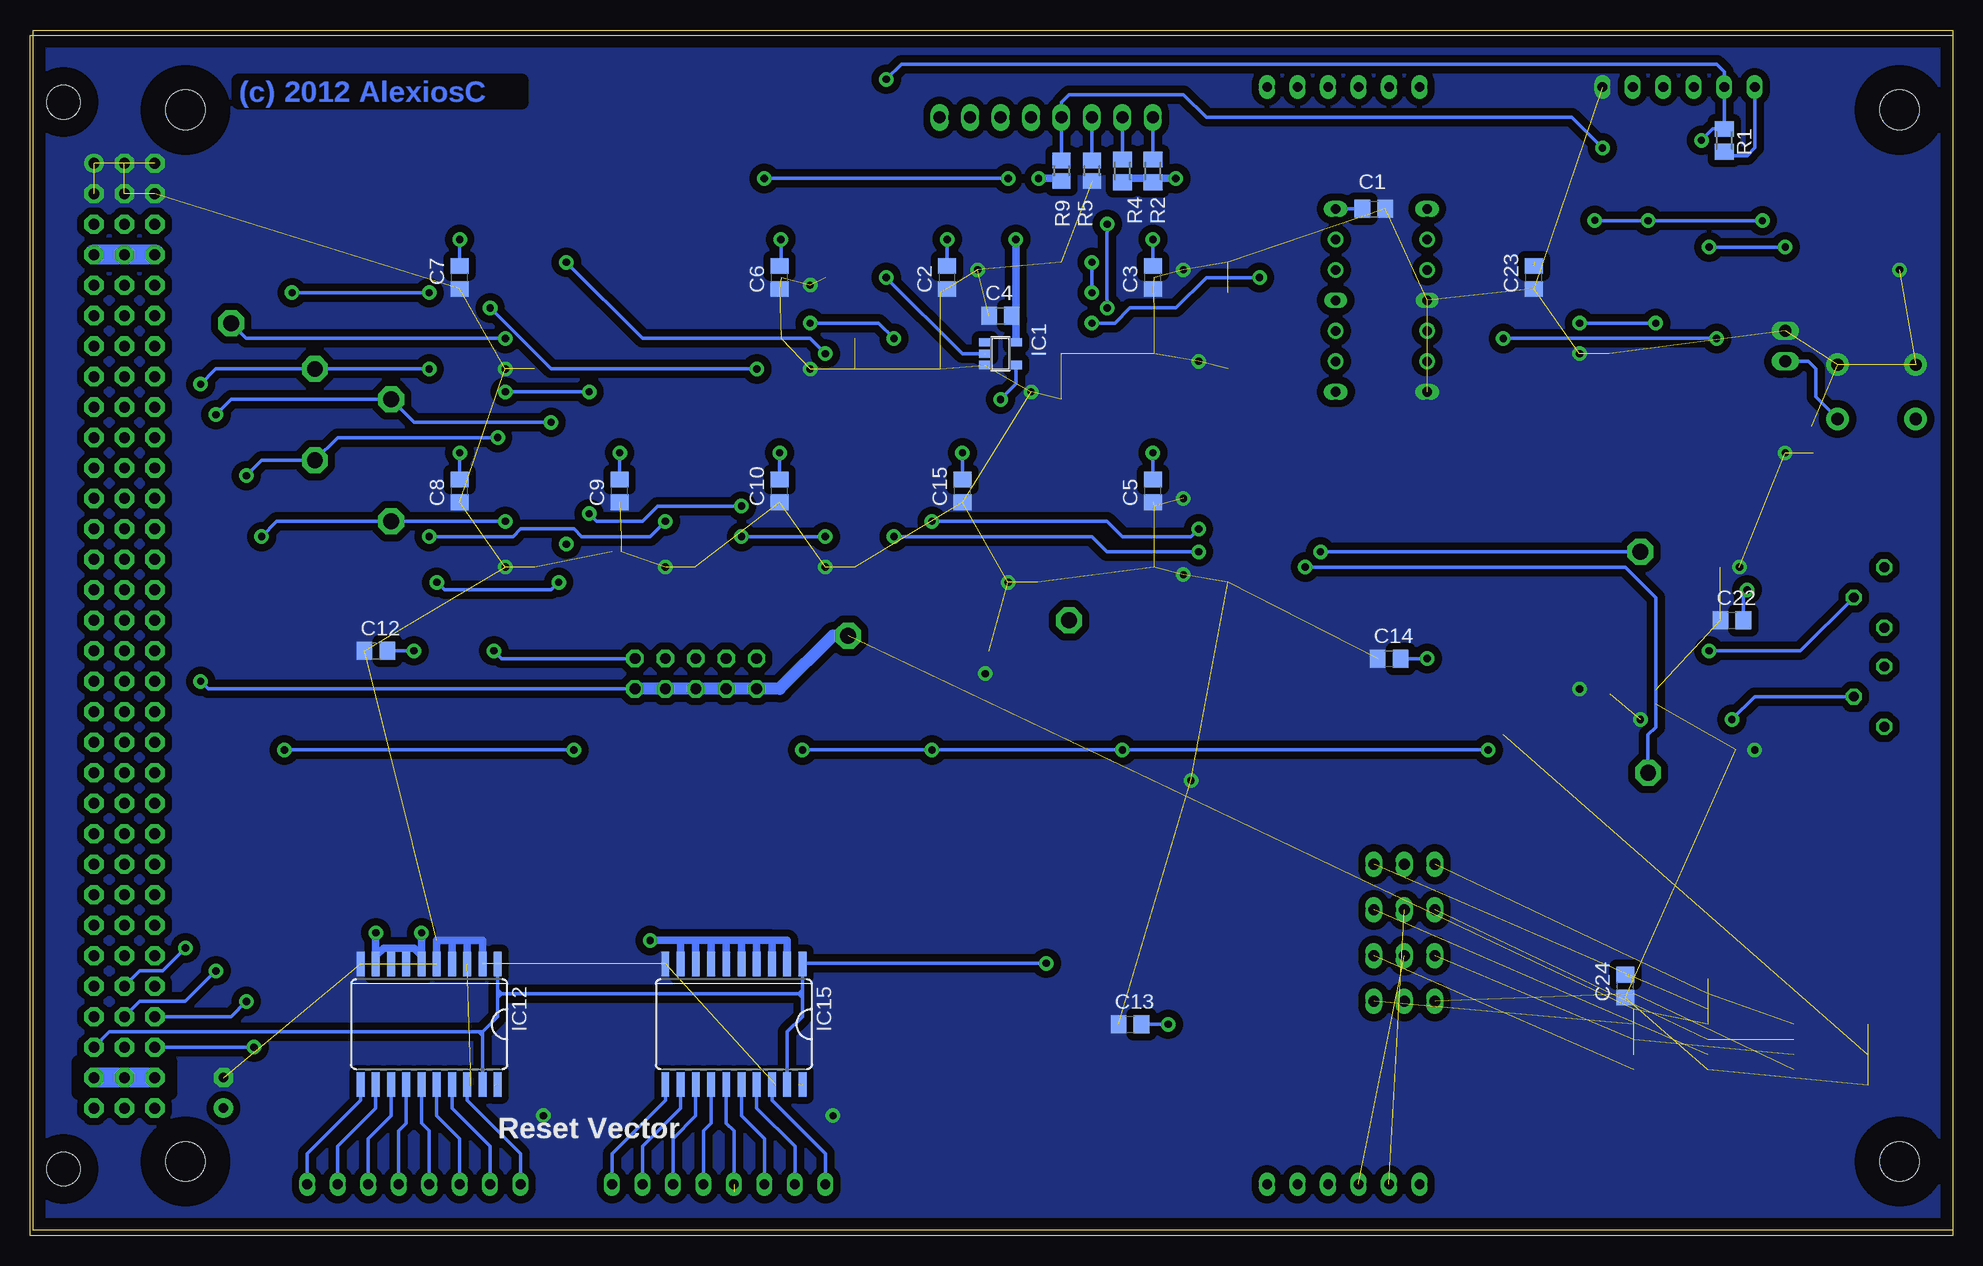
[diagram p5: board, bottom side, seen from below]

Size 160 x 100 mm. Coordinates in mm from the lower left corner, seen from the top.
Outline: 0,0 160,0 160,100 0,100 0,0
Copper layers (1*16): Top 0.035mm / dielectric 1.5mm / Bottom 0.035mm
Design rules "cft-olimex-10mil-small-pads-tented-vias": minimum track width 10mil, minimum drill 24mil, track to track 10mil, track to pad 10mil, pad to pad 10mil, via to via 10mil, smd to smd 10mil, copper to edge 40mil, drill to drill 10mil, minimum pad ring 10mil, minimum via ring 12mil, stop-mask expansion 4mil, vias tented up to drill 30mil, thermal gap 10mil
tRestrict: area 148.6,11.4 to 156.2,14
bRestrict: area 148.6,11.4 to 156.2,14; area 122.6,21.6 to 126.4,22.9

### Footprints (pad centres in the part's own frame; a part is rotated, then mirrored left to right if it is on the bottom)
C0805 = smd 1.3 x 1.5: 1 -0.95,0; 2 0.95,0
C0805' = smd 1.3 x 1.5: 1 -0.85,0; 2 0.85,0
B/3528-21R = smd 1.95 x 2.5: + 1.525,0; - -1.525,0
E2,5-5 = drill 0.813 pad 1.6 round: + -1.27,0 | drill 0.813 pad 1.6 octagon: - 1.27,0
22-23-2081 = drill 1 long: 1 -8.89,0; 2 -6.35,0; 3 -3.81,0; 4 -1.27,0; 5 1.27,0; 6 3.81,0; 7 6.35,0; 8 8.89,0
VG96K = drill 0.914 pad 1.6 round: A1 154.94,39.37 | drill 0.914 pad 1.6 octagon: A2 154.94,36.83; A3 154.94,34.29; A4 154.94,31.75; A5 154.94,29.21; A6 154.94,26.67; A7 154.94,24.13; A8 154.94,21.59; A9 154.94,19.05; A10 154.94,16.51; A11 154.94,13.97; A12 154.94,11.43; A13 154.94,8.89; A14 154.94,6.35; A15 154.94,3.81; A16 154.94,1.27; A17 154.94,-1.27; A18 154.94,-3.81; A19 154.94,-6.35; A20 154.94,-8.89; A21 154.94,-11.43; A22 154.94,-13.97; A23 154.94,-16.51; A24 154.94,-19.05; A25 154.94,-21.59; A26 154.94,-24.13; A27 154.94,-26.67; A28 154.94,-29.21; A29 154.94,-31.75; A30 154.94,-34.29; A31 154.94,-36.83; A32 154.94,-39.37; B1 152.4,39.37; B2 152.4,36.83; B3 152.4,34.29; B4 152.4,31.75; B5 152.4,29.21; B6 152.4,26.67; B7 152.4,24.13; B8 152.4,21.59; B9 152.4,19.05; B10 152.4,16.51; B11 152.4,13.97; B12 152.4,11.43; B13 152.4,8.89; B14 152.4,6.35; B15 152.4,3.81; B16 152.4,1.27; B17 152.4,-1.27; B18 152.4,-3.81; B19 152.4,-6.35; B20 152.4,-8.89; B21 152.4,-11.43; B22 152.4,-13.97; B23 152.4,-16.51; B24 152.4,-19.05; B25 152.4,-21.59; B26 152.4,-24.13; B27 152.4,-26.67; B28 152.4,-29.21; B29 152.4,-31.75; B30 152.4,-34.29; B31 152.4,-36.83; B32 152.4,-39.37; C1 149.86,39.37; C2 149.86,36.83; C3 149.86,34.29; C4 149.86,31.75; C5 149.86,29.21; C6 149.86,26.67; C7 149.86,24.13; C8 149.86,21.59; C9 149.86,19.05; C10 149.86,16.51; C11 149.86,13.97; C12 149.86,11.43; C13 149.86,8.89; C14 149.86,6.35; C15 149.86,3.81; C16 149.86,1.27; C17 149.86,-1.27; C18 149.86,-3.81; C19 149.86,-6.35; C20 149.86,-8.89; C21 149.86,-11.43; C22 149.86,-13.97; C23 149.86,-16.51; C24 149.86,-19.05; C25 149.86,-21.59; C26 149.86,-24.13; C27 149.86,-26.67; C28 149.86,-29.21; C29 149.86,-31.75; C30 149.86,-34.29; C31 149.86,-36.83; C32 149.86,-39.37 | hole 2.794: 157.48,44.45; 157.48,-44.45
STANDOFF_28_60 = hole 3.302: 0,0
SOT23-5 = smd 0.69 x 0.99: 1 -0.95,-1.29; 2 0,-1.29; 3 0.95,-1.29; 4 0.95,1.3; 5 -0.95,1.3
SO20W = smd 0.66 x 2.032: 1 -5.715,-5.029; 2 -4.445,-5.029; 3 -3.175,-5.029; 4 -1.905,-5.029; 5 -0.635,-5.029; 6 0.635,-5.029; 7 1.905,-5.029; 8 3.175,-5.029; 9 4.445,-5.029; 10 5.715,-5.029; 11 5.715,5.029; 12 4.445,5.029; 13 3.175,5.029; 14 1.905,5.029; 15 0.635,5.029; 16 -0.635,5.029; 17 -1.905,5.029; 18 -3.175,5.029; 19 -4.445,5.029; 20 -5.715,5.029
SO16 = smd 0.66 x 2.032: 1 -4.445,-3.073; 2 -3.175,-3.073; 3 -1.905,-3.073; 4 -0.635,-3.073; 5 0.635,-3.073; 6 1.905,-3.073; 7 3.175,-3.073; 8 4.445,-3.073; 9 4.445,3.073; 10 3.175,3.073; 11 1.905,3.073; 12 0.635,3.073; 13 -0.635,3.073; 14 -1.905,3.073; 15 -3.175,3.073; 16 -4.445,3.073
SO14 = smd 0.66 x 2.032: 1 -3.81,-3.073; 2 -2.54,-3.073; 3 -1.27,-3.073; 4 0,-3.073; 5 1.27,-3.073; 6 2.54,-3.073; 7 3.81,-3.073; 8 3.81,3.073; 9 2.54,3.073; 10 1.27,3.073; 11 0,3.073; 12 -1.27,3.073; 13 -2.54,3.073; 14 -3.81,3.073
SO14' = smd 0.6 x 2.2: 1 -3.81,-2.6; 2 -2.54,-2.6; 3 -1.27,-2.6; 4 0,-2.6; 5 1.27,-2.6; 6 2.54,-2.6; 7 3.81,-2.6; 8 3.81,2.6; 9 2.54,2.6; 10 1.27,2.6; 11 0,2.6; 12 -1.27,2.6; 13 -2.54,2.6; 14 -3.81,2.6
JP2 = drill 0.914 long: 1 -2.54,0; 2 0,0; 3 2.54,0
JP5Q = drill 0.914 octagon: 1 -5.08,-1.27; 2 -5.08,1.27; 3 -2.54,-1.27; 4 -2.54,1.27; 5 0,-1.27; 6 0,1.27; 7 2.54,-1.27; 8 2.54,1.27; 9 5.08,-1.27; 10 5.08,1.27
1X02 = drill 1.016 long: 1 -1.27,0; 2 1.27,0
CHIP-LED0805 = smd 1.2 x 1.2: A 0,-1.05; C 0,1.05
FE08 = drill 0.813 long: 1 -8.89,0; 2 -6.35,0; 3 -3.81,0; 4 -1.27,0; 5 1.27,0; 6 3.81,0; 7 6.35,0; 8 8.89,0
FE06 = drill 0.813 long: 1 -6.35,0; 2 -3.81,0; 3 -1.27,0; 4 1.27,0; 5 3.81,0; 6 6.35,0
M0805 = smd 1.3 x 1.6: 1 -0.95,0; 2 0.95,0
R0805 = smd 1.3 x 1.5: 1 -0.85,0; 2 0.85,0
CT6 = drill 0.813 octagon: A 2.515,0; E -2.515,0; S 0,-2.54
TACTILE-PTH = drill 1.016 pad 1.88 round: 1 -3.251,2.261; 2 3.251,2.261; 3 -3.251,-2.261; 4 3.251,-2.261
P1-13 = drill 1.321 pad 2.159 octagon: TP 0,0
DIL0814S = drill 0.813 long: 1 -7.62,-3.81; 7 7.62,-3.81; 8 7.62,3.81; 14 -7.62,3.81 | drill 0.8 round: 2 -5.08,-3.81; 3 -2.54,-3.81; 5 2.54,-3.81; 6 5.08,-3.81; 9 5.08,3.81; 10 2.54,3.81; 12 -2.54,3.81; 13 -5.08,3.81 | drill 0.8 long: 4 0,-3.81; 11 0,3.81

### Placement (x,y rotation side)
C1  48.26,85.09 0 bottom
C2  83.82,79.38 90 bottom
C3  66.67,79.38 90 bottom
C4  79.38,76.2 0 bottom
C5  66.67,61.59 90 bottom
C6  97.79,79.38 90 bottom
C7  124.46,79.38 90 bottom
C8  124.46,61.59 90 bottom
C9  111.12,61.59 90 bottom
C10  97.79,61.59 90 bottom
C11  10nF  [C0805']  10.79,64.77 0 top
C12  131.44,48.26 0 bottom
C13  68.58,17.14 0 bottom
C14  46.99,47.62 0 bottom
C15  82.55,61.59 90 bottom
C16  122.56,12.06 180 top
C17  97.16,12.06 180 top
C18  19.05,40.01 0 top
C19  20.32,55.24 0 top
C20  28.57,43.18 270 top
C21  28.57,50.8 90 top
C22  18.41,50.8 0 bottom
C23  34.92,79.38 90 bottom
C24  27.3,20.32 90 bottom
C25  144.15,11.43 90 top
CON1  75.56,92.71 0 top
EXP1  0,49.53 0 top
H1  4.45,93.34 0 top
H2  147.32,93.34 0 top
H3  147.32,5.71 0 top
H4  4.45,5.71 0 top
IC1  79.38,73.03 270 bottom
IC2  79.38,74.93 270 top
IC3  63.5,76.2 270 top
IC4  63.5,58.42 270 top
IC5  94.61,76.2 270 top
IC6  94.61,59.05 270 top
IC7  107.95,59.05 270 top
IC8  121.28,76.2 270 top
IC9  121.28,59.05 270 top
IC10  13.97,67.94 270 top
IC11  31.75,76.83 270 top
IC12  127,17.14 180 bottom
IC13  79.38,58.42 270 top
IC14  79.38,49.53 0 top
IC15  101.6,17.14 180 bottom
IC16  LM556D  [SO14']  20.95,47.62 0 top
IC17  10.16,16.51 270 top
IC18  23.5,17.14 270 top
J1  45.72,30.48 180 top
J2  45.72,26.67 180 top
J3  45.72,22.86 180 top
J4  45.72,19.05 180 top
JP1  104.78,46.35 0 top
JP2  13.97,73.66 270 top
LED1  5.71,81.92 90 top
LED2  5.71,84.45 90 top
P1  128.27,3.81 0 top
P2  102.87,3.81 0 top
P3  50.8,95.25 0 top
P4  50.8,3.81 0 top
P5  22.86,95.25 0 top
R1  19.05,90.81 270 bottom
R2  66.67,88.27 270 bottom
R3  70.48,62.87 90 top
R4  69.22,88.27 270 bottom
R5  71.75,88.27 90 bottom
R6  10.79,81.92 0 top
R7  4.45,64.77 0 top
R8  10.79,84.45 0 top
R9  74.3,88.27 270 bottom
R10  20.32,67.31 0 top
R11  24.77,78.74 90 top
R12  13.97,45.72 90 top
R13  13.97,50.8 270 top
R14  13.97,40.64 90 top
R15  13.97,55.88 270 top
R16  5.71,44.45 90 top
R17  5.71,52.7 90 top
S1  6.35,69.85 0 top
TP1  25.4,38.1 0 top
TP2  26.04,56.52 0 top
TP3  130.18,59.05 0 top
TP4  143.51,75.56 0 top
TP5  136.53,71.75 0 top
TP6  130.18,69.22 0 top
TP7  136.53,64.14 0 top
TP8  92.08,49.53 0 top
TP9  73.66,50.8 0 top
U$1  74.3,5.71 0 top
XTAL1  47.62,77.47 270 top

### Tracks (layer width: path | path; a pad name or v marks a point on that pad's centre or on a via)
!CLK  (via drill 0.6)
  Top 0.305: IC5.13 98.42,76.83 98.42,75.56 IC5.12 v95.25,75.56 | v88.27,57.78 v88.27,74.3 | IC4.6 v62.87,56.52
  Bottom 0.305: v88.27,74.3 89.53,75.56 v95.25,75.56 | v62.87,56.52 70.48,56.52 71.75,57.78 v88.27,57.78
!CLOCK  (via drill 0.6)
  Top 0.305: IC5.9 v99.69,71.75 | v121.92,76.83 IC8.13
  Bottom 0.305: v99.69,71.75 116.84,71.75 v121.92,76.83
!GUARD  (via drill 0.6)  (4 unrouted)
  Top 0.305: v146.05,45.72 146.05,22.86 147.32,21.59 153.67,21.59 EXP1.A28
  Bottom 0.305: JP1.9 145.41,45.09 v146.05,45.72
  Bottom 1.016: JP1.9 JP1.7 JP1.5 JP1.3 JP1.1 97.79,45.09 93.34,49.53 TP8.TP
!RDR  (1 unrouted)
!RESET  (via drill 0.6)  (1 unrouted)
  Top 0.305: IC4.15 70.17,61.59 R3.1 70.48,60.33 68.58,58.42 68.58,40.64 v69.22,40.01 | IC8.15 125.09,79.38 125.09,78.11 | 125.09,78.11 IC8.14 | v141.6,15.24 139.7,17.14 139.7,39.37 v139.06,40.01 139.7,40.64 139.7,76.83 v138.43,78.11 | v127,78.11 125.09,78.11 | IC11.2 27.3,79.38 26.67,78.74 26.67,74.93 27.3,74.3 IC11.6 32.38,74.3 33.66,73.03 IC11.8 36.83,73.03 37.47,72.39 37.47,41.27 v38.73,40.01 | v95.89,40.01 v114.94,40.01 | IC13.10 83.82,55.24 84.45,54.61 84.45,40.64 v85.09,40.01
  Bottom 0.305: v141.6,15.24 EXP1.C30 | v138.43,78.11 v127,78.11 | v38.73,40.01 v69.22,40.01 v85.09,40.01 v95.89,40.01 | v114.94,40.01 v139.06,40.01
!RESET-IN  (via drill 0.6)
  Top 0.305: IC11.1 27.94,80.64 27.94,88.9 v29.21,90.17
  Bottom 0.305: R9.1 CON1.4 74.3,93.98 73.66,94.61 64.14,94.61 62.23,92.71 31.75,92.71 v29.21,90.17
!RPC  (1 unrouted)
!RSTHOLD  (via drill 0.6)
  Top 0.305: v75.56,22.23 73.66,24.13 TP9.TP 75.56,50.8 76.83,52.07 80.33,52.07 | 80.33,52.07 IC14.4 | 80.33,52.07 80.33,56.83 81.28,57.78 IC13.12
  Bottom 0.305: 95.89,19.68 95.89,19.37 | 95.89,20 95.89,19.68 | IC15.19 97.16,16.51 95.89,17.78 95.89,19.37 | 122.56,16.51 122.56,16.19 | 121.28,19.68 121.28,19.37 | 121.28,19.68 121.28,20 | EXP1.A30 153.67,16.51 122.87,16.51 | 122.56,16.51 122.87,16.51 | 122.56,16.51 121.28,17.78 121.28,19.37 | 122.56,16.19 122.87,16.51 | 122.56,16.19 IC12.19 | 120.97,19.68 121.28,19.68 | 120.97,19.68 121.28,20 | 121.28,20 IC12.1 | 120.97,19.68 121.28,19.37 | 95.89,19.68 96.2,19.68 | 96.2,19.68 95.89,19.37 | 96.2,19.68 120.97,19.68 | 95.89,20 96.2,19.68 | 95.89,20 IC15.1 95.83,22.23 v75.56,22.23
+3.3V
  Bottom 1.676: EXP1.C4 EXP1.B4 EXP1.A4
+12V
  Bottom 1.676: EXP1.C31 EXP1.B31 EXP1.A31
CLK  (via drill 0.6)
  Top 0.305: IC5.3 90.81,78.11 90.81,76.83 | 90.81,76.83 IC5.4 | 90.81,76.83 88.27,76.83 87,75.56 87,60.96 v85.09,59.05 | IC4.5 62.23,57.78 v62.87,58.42 | v85.09,59.05 IC13.13 | IC13.11 84.45,56.52 85.09,57.15 v85.09,59.05
  Bottom 0.305: v62.87,58.42 63.5,57.78 69.22,57.78 70.48,59.05 v85.09,59.05
CLK1  (via drill 0.6)
  Top 0.305: EXP1.A29 153.67,19.05 144.78,19.05 143.51,20.32 TP4.TP | v120.65,74.3 IC8.6
  Bottom 0.305: TP4.TP 142.24,74.3 v120.65,74.3
CLK2  (via drill 0.6)
  Top 0.305: IC8.7 116.84,73.03 116.2,72.39 116.2,67.94 v116.84,67.31 116.2,66.67 116.2,63.5 116.84,62.87 IC9.1 | v144.78,21.59 v144.78,67.94
  Bottom 0.305: EXP1.B29 151.13,19.05 147.32,19.05 v144.78,21.59 | v144.78,67.94 143.51,69.22 TP6.TP 128.27,67.31 v116.84,67.31
CLK3  (via drill 0.6)
  Top 0.305: EXP1.B30 151.13,16.51 142.24,16.51 140.97,17.78 v140.97,57.78 | IC8.5 116.84,75.56 114.94,73.66 114.94,63.5 116.84,61.59 | 116.84,61.59 IC9.2 | 116.84,61.59 116.2,60.96 116.2,59.69 116.84,59.05 IC9.4 v120.65,59.05
  Bottom 0.305: v140.97,57.78 139.7,59.05 TP3.TP v120.65,59.05
CLK4  (via drill 0.6)
  Top 0.305: IC9.5 116.2,57.78 v115.57,57.15 115.57,58.42 114.94,59.05 114.94,62.23 113.67,63.5 v113.67,69.85 | v120.65,69.85 122.56,71.75 IC8.9 v127,71.75 | v147.32,23.5 147.32,46.99 146.05,48.26 v146.05,70.48
  Bottom 0.305: v120.65,69.85 v113.67,69.85 | EXP1.B28 151.13,21.59 149.22,21.59 v147.32,23.5 | v146.05,70.48 144.78,71.75 TP5.TP v127,71.75
CLK5  (via drill 0.6)
  Top 0.305: IC9.3 120.02,60.33 120.65,60.96 120.65,65.41 v121.28,66.04 | v142.24,19.05 v142.24,62.87
  Bottom 0.305: EXP1.C29 143.51,17.78 v142.24,19.05 | v142.24,62.87 140.97,64.14 TP7.TP 134.62,66.04 v121.28,66.04
CLKEN  (via drill 0.6)
  Top 0.305: IC5.2 v88.9,79.38 v88.9,95.89 | R6.2 v13.97,81.92 | v20.95,90.81 20.95,82.55 v20.32,81.92
  Bottom 0.305: IC1.2 82.55,73.03 v88.9,79.38 | v88.9,95.89 87.63,97.16 19.68,97.16 19.05,96.52 P5.2 R1.1 20,91.75 v20.95,90.81 | v13.97,81.92 v20.32,81.92
CLOCK  (via drill 0.6)
  Top 0.305: IC5.7 v93.98,73.03 | v115.57,80.64 IC8.1
  Bottom 0.305: v93.98,73.03 95.25,74.3 109.22,74.3 v115.57,80.64
FASTCLK
  Top 0.305: XTAL1.11 52.7,77.47 53.34,76.83 | 53.34,76.83 53.34,70.48 52.7,69.85 XTAL1.8 | 53.34,76.83 IC3.4
FPFAST  (via drill 0.6)
  Top 0.305: v71.75,78.11 IC2.3 | v71.75,80.64 66.67,85.72 CON1.1
  Bottom 0.305: CON1.1 R2.1 | v71.75,78.11 v71.75,80.64
FPSLOW  (via drill 0.6)
  Top 0.305: v70.48,76.83 IC2.4 | CON1.2 69.22,85.09 v70.48,83.82
  Bottom 0.305: v70.48,76.83 v70.48,83.82 | CON1.2 R4.1
FPUSTEP  (via drill 0.6)
  Top 0.305: IC5.14 99.69,78.11 100.33,78.74 100.33,86.36 v99.06,87.63 | v78.74,87.63 77.47,88.9 73.03,88.9 71.75,90.17 CON1.3
  Bottom 0.305: R5.2 CON1.3 | v78.74,87.63 v99.06,87.63
GND  (via drill 0.6)  (97 unrouted)
  Top 0.305: C11.2 11.43,64.98 | 11.43,64.98 11.43,66.67 11.75,67 IC10.3 | 11.43,64.98 11.43,64.77 | v16.51,40.01 C18.1 | C19.1 v17.78,55.24 | IC16.7 24.77,43.81 v26.04,42.55 | 28.57,45.09 C21.- | C20.- 28.57,45.09 | 28.57,45.09 v31.11,45.09 | IC7.10 111.76,57.78 | IC7.9 111.76,56.52 | C17.1 98.11,10.47 97.16,9.53 v93.34,9.53 | C16.1 123.5,10.47 122.56,9.53 v117.47,9.53
  Top 0.61: LED2.C 4.45,84.45 4.45,82.14 LED1.C 4.45,81.92 v4.45,80.01 | IC5.1 93.34,80.64 93.98,80.01 93.98,79.38 | IC14.3 80.64,47.92 v80.64,46.35
  Bottom 0.61: IC12.2 122.56,24.13 123.83,24.13 | IC12.3 123.83,24.13 | 125.09,24.13 IC12.4 | IC12.5 126.36,24.13 125.09,24.13 | 123.83,24.13 125.09,24.13
  other vias: 63.5,37.47 13.97,64.77 31.11,73.03 76.83,69.85 81.28,80.01 62.87,72.39 95.25,71.75 64.14,54.61 120.65,71.75 95.25,78.74 64.14,60.96 93.98,55.24 107.31,55.24 120.65,55.24 64.14,80.01 78.74,53.98
  pour Bottom (isolate 0.61, no thermals, hatched): 153.67,100.33 153.67,0 160.02,0 160.02,100.33
  pour Bottom (isolate 0.61, rank 6, no thermals): 0,100.33 160.02,100.33 160.02,0 0,0
  pour Top (isolate 0.61, rank 5, no thermals): 14.61,67.31 12.06,67.31 11.43,66.67 11.43,64.14 14.61,64.14
  pour Top (isolate 0.61, rank 5, no thermals): 74.3,80.96 74.3,69.22 84.45,69.22 84.45,78.74 83.19,78.74 83.19,79.38 81.6,80.96
  pour Top (isolate 0.61, rank 5, no thermals): 92.08,79.38 97.16,79.38 97.16,71.12 90.49,71.12 90.49,72.07 92.08,72.07
  pour Top (isolate 0.61, rank 5, no thermals): 60.96,61.59 66.04,61.59 66.04,53.34 59.37,53.34 59.37,54.29 60.96,54.29
  pour Top (isolate 0.61, rank 5, no thermals): 104.14,55.24 104.14,54.61 110.49,54.61 110.49,59.05 104.14,59.05
  pour Top (isolate 0.61, rank 5, no thermals): 118.11,55.88 118.11,54.61 122.56,54.61 122.56,55.88
  pour Top (isolate 0.61, rank 5, no thermals): 91.44,55.88 91.44,54.61 96.52,54.61 96.52,55.88
  pour Top (isolate 0.61, rank 5, no thermals): 60.96,80.64 64.77,80.64 64.77,79.69 66.04,79.69 66.04,71.12 59.37,71.12 59.37,72.07 60.96,72.07
  pour Top (isolate 0.61, rank 5, no thermals): 118.11,72.39 118.11,71.12 122.56,71.12 122.56,72.39
  pour Top (isolate 0.61, rank 5, no thermals): 28.57,73.66 28.57,72.39 33.02,72.39 33.02,73.66
  pour Top (isolate 0.61, rank 5, no thermals): 76.2,54.61 76.2,53.34 81.28,53.34 81.28,54.61
IBUS0
  Bottom 0.305: IC12.18 123.83,10.79 119.38,6.35 P1.1
IBUS1
  Bottom 0.305: P1.2 121.92,6.99 125.09,10.16 IC12.17
IBUS2
  Bottom 0.305: IC12.16 126.36,9.53 124.46,7.62 P1.3
IBUS3
  Bottom 0.305: P1.4 127,8.26 127.64,8.89 IC12.15
IBUS4
  Bottom 0.305: IC12.14 128.91,8.89 129.54,8.26 P1.5
IBUS5
  Bottom 0.305: IC12.13 130.18,9.53 132.08,7.62 P1.6
IBUS6
  Bottom 0.305: IC12.12 131.44,10.16 134.62,6.99 P1.7
IBUS7
  Bottom 0.305: IC12.11 132.72,10.79 137.16,6.35 P1.8
IBUS8
  Bottom 0.305: IC15.18 98.42,10.79 93.98,6.35 P2.1
IBUS9
  Bottom 0.305: IC15.17 99.69,10.16 96.52,6.99 P2.2
IBUS10
  Bottom 0.305: IC15.16 100.97,9.53 99.06,7.62 P2.3
IBUS11  (1 unrouted)
  Bottom 0.305: IC15.15 102.23,8.89 101.6,8.26 101.6,3.17
IBUS12
  Bottom 0.305: IC15.14 103.5,8.89 104.14,8.26 P2.5
IBUS13
  Bottom 0.305: IC15.13 104.78,9.53 106.68,7.62 P2.6
IBUS14
  Bottom 0.305: IC15.12 106.05,10.16 109.22,6.99 P2.7
IBUS15
  Bottom 0.305: IC15.11 107.31,10.79 111.76,6.35 P2.8
N$2
  Top 0.305: IC6.8 97.69,51.54 99.69,49.53 JP1.2
N$5
  Top 0.305: IC14.2 79.38,48.9 80.01,49.53 81.92,49.53 82.55,50.16 82.55,53.87 IC13.9
N$6
  Top 0.305: IC16.3 19.68,43.18 20.32,42.55 20.32,40.33 C18.2
N$8  (via drill 0.6)
  Top 0.305: IC10.4 15.3,66.97 17.43,66.97 17.78,67.31 R10.1 19.47,67.53 19.05,67.94 19.05,73.66 v19.68,74.3 | v37.47,74.3 IC11.9
  Bottom 0.305: v19.68,74.3 v37.47,74.3
N$9  (via drill 0.6)
  Top 0.305: C21.+ 28.57,52.7 25.4,52.7 24.77,52.07 IC16.8 24.77,48.9 24.13,48.26 v20.32,48.26 19.68,48.9 IC16.12
  Bottom 0.305: R17.S 12.7,48.26 v20.32,48.26
N$10
  Top 0.305: S1.4 S1.3 3.1,65.48 3.6,64.98 R7.1 | C11.1 9.6,65.11 S1.4 | S1.4 9.96,67.94 IC10.2
  Bottom 0.305: JP2.2 12.06,72.39 11.43,71.75 11.43,69.42 S1.4
N$11
  Top 0.305: IC7.1 104.14,62.87 104.14,61.59 | 104.14,61.59 IC7.2 | JP1.6 104.78,50.16 102.87,52.07 102.87,55.88 103.5,56.52 | 103.5,56.52 IC7.6 | 103.5,56.52 102.87,57.15 102.87,60.96 103.5,61.59 104.14,61.59
N$12
  Top 0.305: IC7.3 IC7.12 111.76,60.33 111.76,61.59 IC7.13
N$13  (via drill 0.6)
  Top 0.305: IC6.13 98.42,61.59 98.42,60.33 IC6.12 v100.97,60.33 | IC7.11 113.03,59.05 v113.67,59.69 113.67,53.98 111.76,52.07 109.22,52.07 107.31,50.16 JP1.8
  Bottom 0.305: v100.97,60.33 107.95,60.33 109.22,59.05 113.03,59.05 v113.67,59.69
N$14
  Top 0.305: IC6.1 90.81,62.87 90.81,61.59 IC6.2 93.34,61.59 95.89,59.05 IC6.11
N$15  (via drill 0.6)
  Top 0.305: 90.81,59.05 90.81,57.78 IC6.5 v93.98,57.78 | IC6.3 90.81,60.33 90.81,59.05 | 90.81,59.05 IC6.4 | v100.97,57.78 100.97,51.44 102.23,50.16 JP1.4
  Bottom 0.305: v93.98,57.78 v100.97,57.78
N$16
  Top 0.305: IC6.10 98.42,57.78 98.42,56.52 IC6.9 IC6.6
N$17  (2 unrouted)
N$18  (via drill 0.6)
  Top 0.305: IC9.10 125.09,57.78 125.09,56.52 | 125.09,56.52 IC9.9 | IC9.6 116.84,56.52 116.2,55.88 v116.2,53.98 | v126.36,53.98 126.36,55.88 125.73,56.52 125.09,56.52
  Bottom 0.305: v116.2,53.98 116.84,53.34 125.73,53.34 v126.36,53.98
N$19  (via drill 0.6)
  Top 0.305: IC9.13 125.09,61.59 125.09,60.33 IC9.12 123.19,60.33 122.56,59.69 122.56,55.88 123.35,55.09 | v121.6,48.26 122.24,48.9 122.24,53.98 123.35,55.09 | IC9.8 123.51,55.24 123.35,55.09
  Bottom 0.305: JP1.10 120.97,47.62 v121.6,48.26
N$20  (via drill 0.6)
  Top 0.305: IC7.5 104.14,57.78 104.14,59.05 IC7.4 v107.31,59.05 | v127,57.78 127,58.42 126.36,59.05 IC9.11
  Bottom 0.305: v107.31,59.05 108.58,57.78 114.3,57.78 114.94,58.42 119.38,58.42 120.02,57.78 v127,57.78
N$21  (2 unrouted)
N$22  (2 unrouted)
N$23  (2 unrouted)
N$24  (1 unrouted)
N$25  (1 unrouted)
N$26  (1 unrouted)
N$27  (1 unrouted)
N$28  (via drill 0.6)
  Top 0.305: IC11.4 27.94,76.83 27.94,75.56 IC11.5 v31.11,75.56 | v24.77,75.56 R11.1
  Bottom 0.305: v24.77,75.56 v31.11,75.56
N$29
  Top 0.305: IC16.1 17.14,44.45 13.97,44.45 R12.1 R14.2
N$30
  Top 0.305: R15.2 R13.1 15.03,51.65 15.24,51.44 15.24,48.9 15.88,48.26 17.78,48.26 18.41,48.9 IC16.13
N$31  (via drill 0.6)
  Top 0.305: C20.+ 28.2,41.27 24.77,41.27 23.5,42.55 IC16.6 23.5,46.35 22.86,46.99 19.05,46.99 18.41,46.35 IC16.2 v18.41,42.55
  Bottom 0.305: R16.S 16.51,44.45 v18.41,42.55
N$32
  Top 0.305: R16.A 10.19,46.97 11.43,45.72 11.43,40.01 12.06,39.37 13.55,39.37 R14.1
N$33
  Top 0.305: R15.1 13.55,57.15 12.06,57.15 10.13,55.22 R17.A
N$34
  Top 0.305: IC3.14 69.85,78.11 71.12,79.38 IC2.2
N$35  (via drill 0.6)
  Top 0.305: v57.78,79.38 IC3.2 | v71.75,75.56 IC2.5
  Bottom 0.305: v71.75,75.56 69.85,75.56 68.58,76.83 64.77,76.83 62.23,79.38 v57.78,79.38
N$36
  Top 0.305: IC16.11 20.95,52.7 21.59,53.34 21.59,54.92 C19.2
N$37  (via drill 0.6)
  Top 0.305: v79.38,69.22 IC2.11
  Bottom 0.305: IC1.4 78.08,70.52 v79.38,69.22
N$49
  Top 0.305: LED1.A R6.1
POWERLED
  Top 0.305: LED2.A R8.1
POWEROK  (via drill 0.6)
  Top 0.305: R8.2 13.97,84.45 14.31,84.12 v15.88,84.12 | v29.84,84.14 30.48,83.5 30.48,78.74 29.84,78.11 IC11.3 | P5.5 26.67,85.39 v25.4,84.12
  Bottom 0.305: v29.84,84.14 29.82,84.12 v25.4,84.12 v15.88,84.12
RAWCLK
  Top 0.305: IC3.7 57.78,73.03 57.15,72.39 57.15,63.5 57.78,62.87 IC4.1
SLOWCLK  (via drill 0.6)
  Top 0.305: IC16.5 22.23,42.55 23.5,41.27 23.5,40.01 TP1.TP | IC3.6 57.15,74.3 55.88,73.03 55.88,63.5 54.61,62.23 54.61,55.88 v53.98,55.24
  Bottom 0.305: v53.98,55.24 27.3,55.24 24.77,52.7 24.77,41.91 25.4,41.27 TP1.TP
TESTCLK  (via drill 0.6)
  Top 0.305: IC16.9 23.5,52.07 24.77,53.34 24.77,55.24 TP2.TP | v52.7,56.52 53.34,57.15 53.34,62.87 54.61,64.14 54.61,73.66 56.52,75.56 IC3.5
  Bottom 0.305: TP2.TP v52.7,56.52
VCC  (via drill 0.6)  (4 unrouted)
  Top 0.305: IC5.16 v97.69,82.55 97.69,83.08
  Bottom 0.305: C22.2 17.46,53.02 v17.14,53.34 | C1.1 XTAL1.14 | C2.2 v83.82,82.55 | C10.2 v97.79,64.77 | C9.2 v111.12,64.77 | C8.2 v124.46,64.77 | C15.2 v82.55,64.77 | C6.2 97.69,80.43 v97.69,82.55 | C5.2 v66.67,64.77 | C7.2 v124.46,82.55 | 66.67,87.63 R2.2 | IC12.7 128.91,22.86 | 130.18,22.86 IC12.8 | P5.1 16.51,90.17 17.14,89.53 18.73,89.53 R1.2 | C3.2 v66.67,82.55 | 68.89,87.63 68.9,87.63 R4.2 | 74.72,87.63 74.51,87.63 R9.2 | v43.81,47.62 C14.2 | v65.41,17.14 C13.2 | v128.27,48.26 C12.2
  Bottom 0.61: v64.77,87.63 66.67,87.63 68.89,87.63 | IC1.5 78.08,75.85 C4.2 78.11,76.2 v78.11,82.55 | 127.64,22.86 IC12.6 | 127.64,22.86 128.27,23.5 128.91,23.5 | 128.91,22.86 128.91,23.5 | 128.91,23.5 130.18,23.5 | 130.18,23.5 130.18,22.86 | 131.44,22.86 IC12.9 | 127.64,22.86 v127.64,24.77 | 130.18,23.5 130.81,23.5 131.44,22.86 | 131.44,22.86 v131.44,24.77 | IC15.3 98.42,24.13 | 99.69,24.13 IC15.4 | 100.97,24.13 IC15.5 | 106.05,24.13 IC15.9 | 98.42,24.13 99.69,24.13 | 99.69,24.13 100.97,24.13 | 100.97,24.13 102.23,24.13 | 102.23,24.13 IC15.6 | 102.23,24.13 103.5,24.13 | 103.5,24.13 IC15.7 | 103.5,24.13 104.78,24.13 | 104.78,24.13 IC15.8 | 104.78,24.13 106.05,24.13 | IC15.2 97.16,24.13 98.42,24.13 | 106.05,24.13 v108.58,24.13 | 74.72,87.63 v76.2,87.63
  pour Top (isolate 0.61, rank 2, no thermals): 153.67,100.33 153.67,0 160.02,0 160.02,100.33
  pour Top (isolate 0.61, rank 6, no thermals): 0,100.33 160.02,100.33 160.02,0 0,0

### Text on the board
Top: (c) 2012 AlexiosC
Bottom: (c) 2012 AlexiosC
tNames: WUNIT | http://www.bedroomlan.org/cft | CLKGEN | (c) 2012 AlexiosC | Power | Run/Step/Stop Mux | 90° Phases | Run | Reset | CFT BUS REV J | CLK1 | Clock Sel | CLK4 | !GUARD! Generation | CLK2 | 180° Phases | CLK5 | Test Clk | TESTCLK | 9-22Hz | CLK3 | !GUARD | !RSTHOLD | !RSTHOLD! Gen | 90-215Hz | Slow Clk Gen | +5 | +4 | +3 | +2 | +1 | Slow Clk | SLOWCLK | !GUARD! delay | ONE JUMPER ONLY! | AGL | Read Unit Decoder | PC | & !GUARD! assignment | DR | AC | CFT Clock Generator & Reset Rev D | !GUARD! Pulse | Disabled | Enabled | RUNIT/INC | IBUS | HI | LO
bNames: Reset Vector
tValues: +12V